# EAGLE design cnc_1_0_0 (EAGLE 6.2)

## Sheet 1 of 9
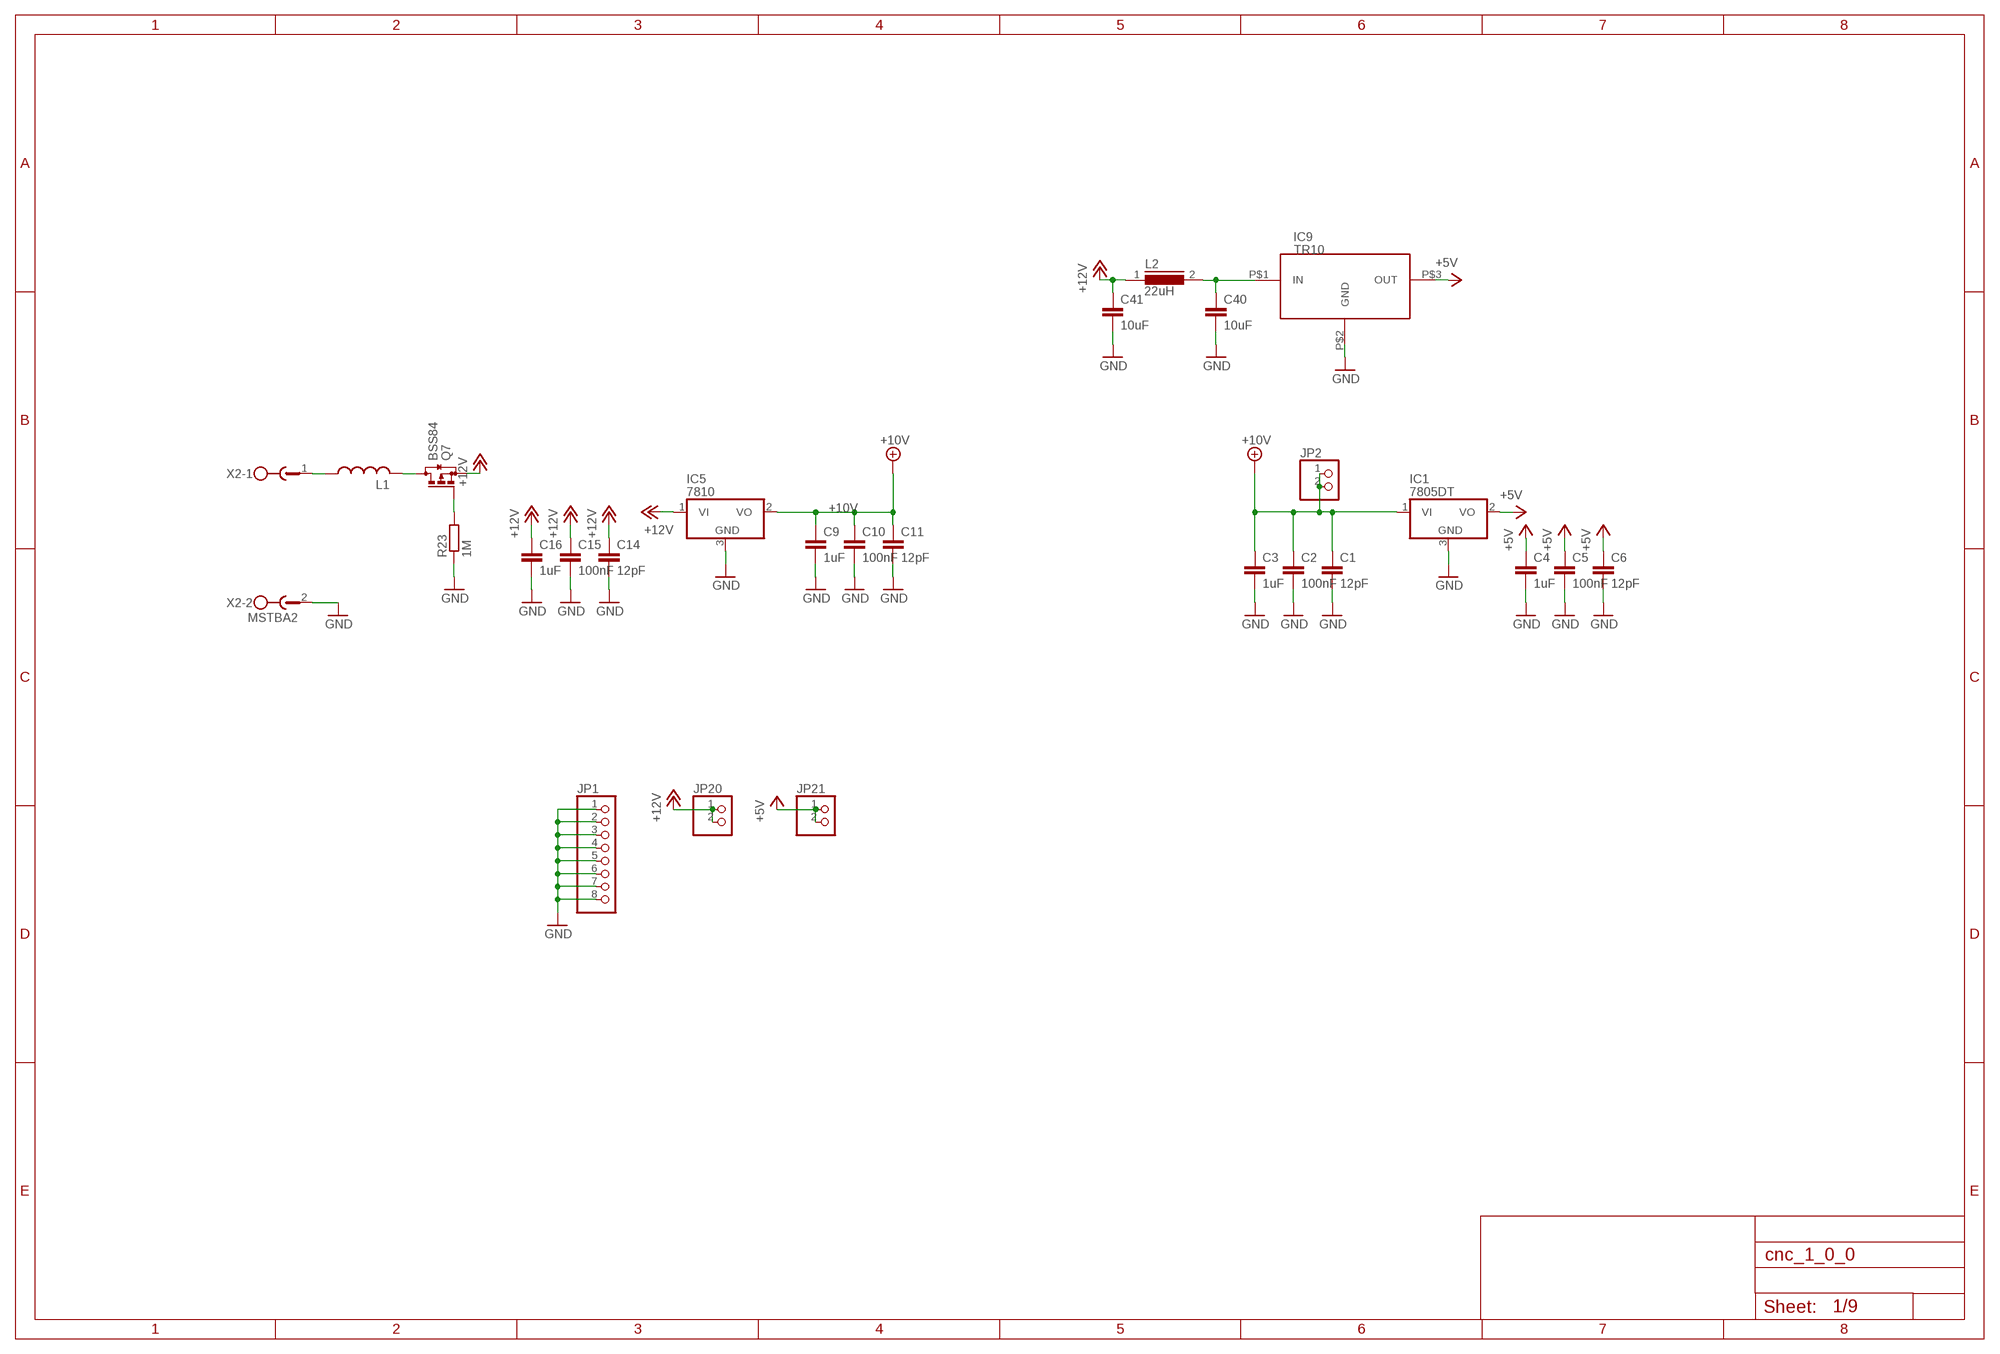
[diagram p0: schematic, sheet 1]

### Parts
C1  12pF  C-EUC0805K  [C0805K]
C2  100nF  C-EUC0805K  [C0805K]
C3  1uF  C-EUC0805K  [C0805K]
C4  1uF  C-EUC0805K  [C0805K]
C5  100nF  C-EUC0805K  [C0805K]
C6  12pF  C-EUC0805K  [C0805K]
C9  1uF  C-EUC0805K  [C0805K]
C10  100nF  C-EUC0805K  [C0805K]
C11  12pF  C-EUC0805K  [C0805K]
C14  12pF  C-EUC0805K  [C0805K]
C15  100nF  C-EUC0805K  [C0805K]
C16  1uF  C-EUC0805K  [C0805K]
C40  10uF  C-EUC0805K  [C0805K]
C41  10uF  C-EUC0805K  [C0805K]
IC1  7805DT  [TO252]
IC5  7810  7805DT  [TO252]
IC9  TR10  [TR10]
JP1  PINHD-1X8  [1X08]
JP2  PINHD-1X2  [1X02]
JP20  PINHD-1X2  [1X02]
JP21  PINHD-1X2  [1X02]
L1  L-USL1812  [L1812]
L2  22uH  DR127  [DR127]
Q7  BSS84  [SOT23]
R23  1M  R-EU_R0805  [R0805]
X2  MSTBA2  [MSTBA2]

### Nets
+5V [pwr]: C4.1 C5.1 C6.1 IC1.2(VO) IC9.P$3(OUT) JP21.1 JP21.2 ; also sheet 3,4,5
+10V [pwr]: C1.1 C2.1 C3.1 C9.1 C10.1 C11.1 IC1.1(VI) IC5.2(VO) JP2.1 JP2.2 ; also sheet 4
+12V [pwr]: C14.1 C15.1 C16.1 C41.1 IC5.1(VI) JP20.1 JP20.2 L2.1 Q7.2(S) ; also sheet 5,7
GND: C1.2 C2.2 C3.2 C4.2 C5.2 C6.2 C9.2 C10.2 C11.2 C14.2 C15.2 C16.2 C40.2 C41.2 IC1.3(GND) IC5.3(GND) IC9.P$2(GND) JP1.1 JP1.2 JP1.3 JP1.4 JP1.5 JP1.6 JP1.7 JP1.8 R23.1 X2.2 ; also sheet 2,3,4,5,6,7
N$1: L1.1 X2.1
N$24: L1.2 Q7.3(D)
N$25: Q7.1(G) R23.2
N$26: C40.1 IC9.P$1(IN) L2.2

## Sheet 2 of 9
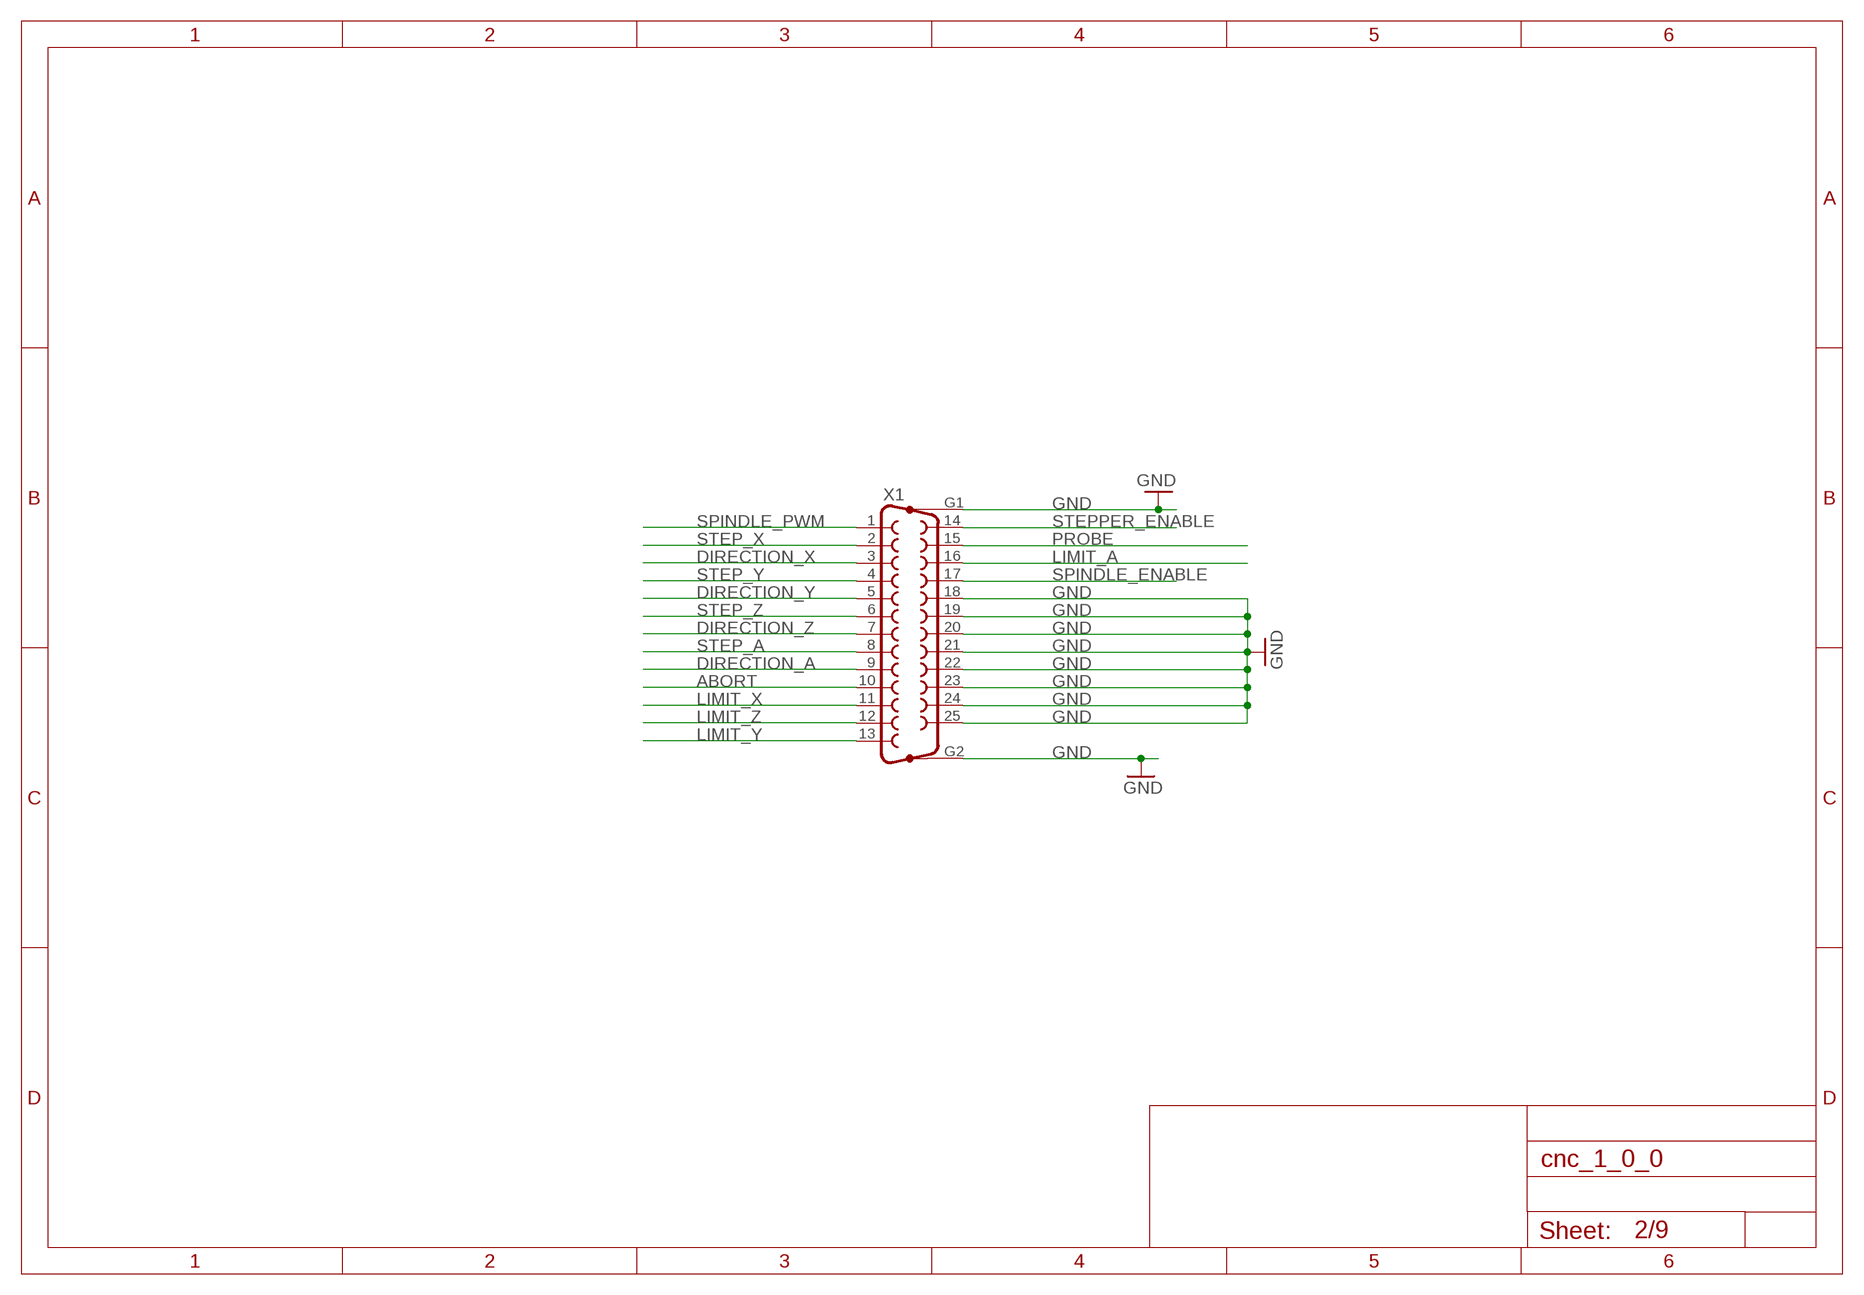
[diagram p1: schematic, sheet 2]

### Parts
X1  F25HP  [F25HP]

### Nets
ABORT: X1.10 ; also sheet 3,5
DIRECTION_A: X1.9 ; also sheet 3,4
DIRECTION_X: X1.3 ; also sheet 3,4
DIRECTION_Y: X1.5 ; also sheet 3,4
DIRECTION_Z: X1.7 ; also sheet 3,4
GND: X1.18 X1.19 X1.20 X1.21 X1.22 X1.23 X1.24 X1.25 X1.G1 X1.G2 ; also sheet 1,3,4,5,6,7
LIMIT_A: X1.16
LIMIT_X: X1.11 ; also sheet 3,5
LIMIT_Y: X1.13 ; also sheet 3,5
LIMIT_Z: X1.12 ; also sheet 3,5
PROBE: X1.15 ; also sheet 3,5
SPINDLE_ENABLE: X1.17 ; also sheet 3,4
SPINDLE_PWM: X1.1 ; also sheet 3,4
STEP_A: X1.8 ; also sheet 3,4
STEP_X: X1.2 ; also sheet 3,4
STEP_Y: X1.4 ; also sheet 3,4
STEP_Z: X1.6 ; also sheet 3,4
STEPPER_ENABLE: X1.14 ; also sheet 3,4

## Sheet 3 of 9
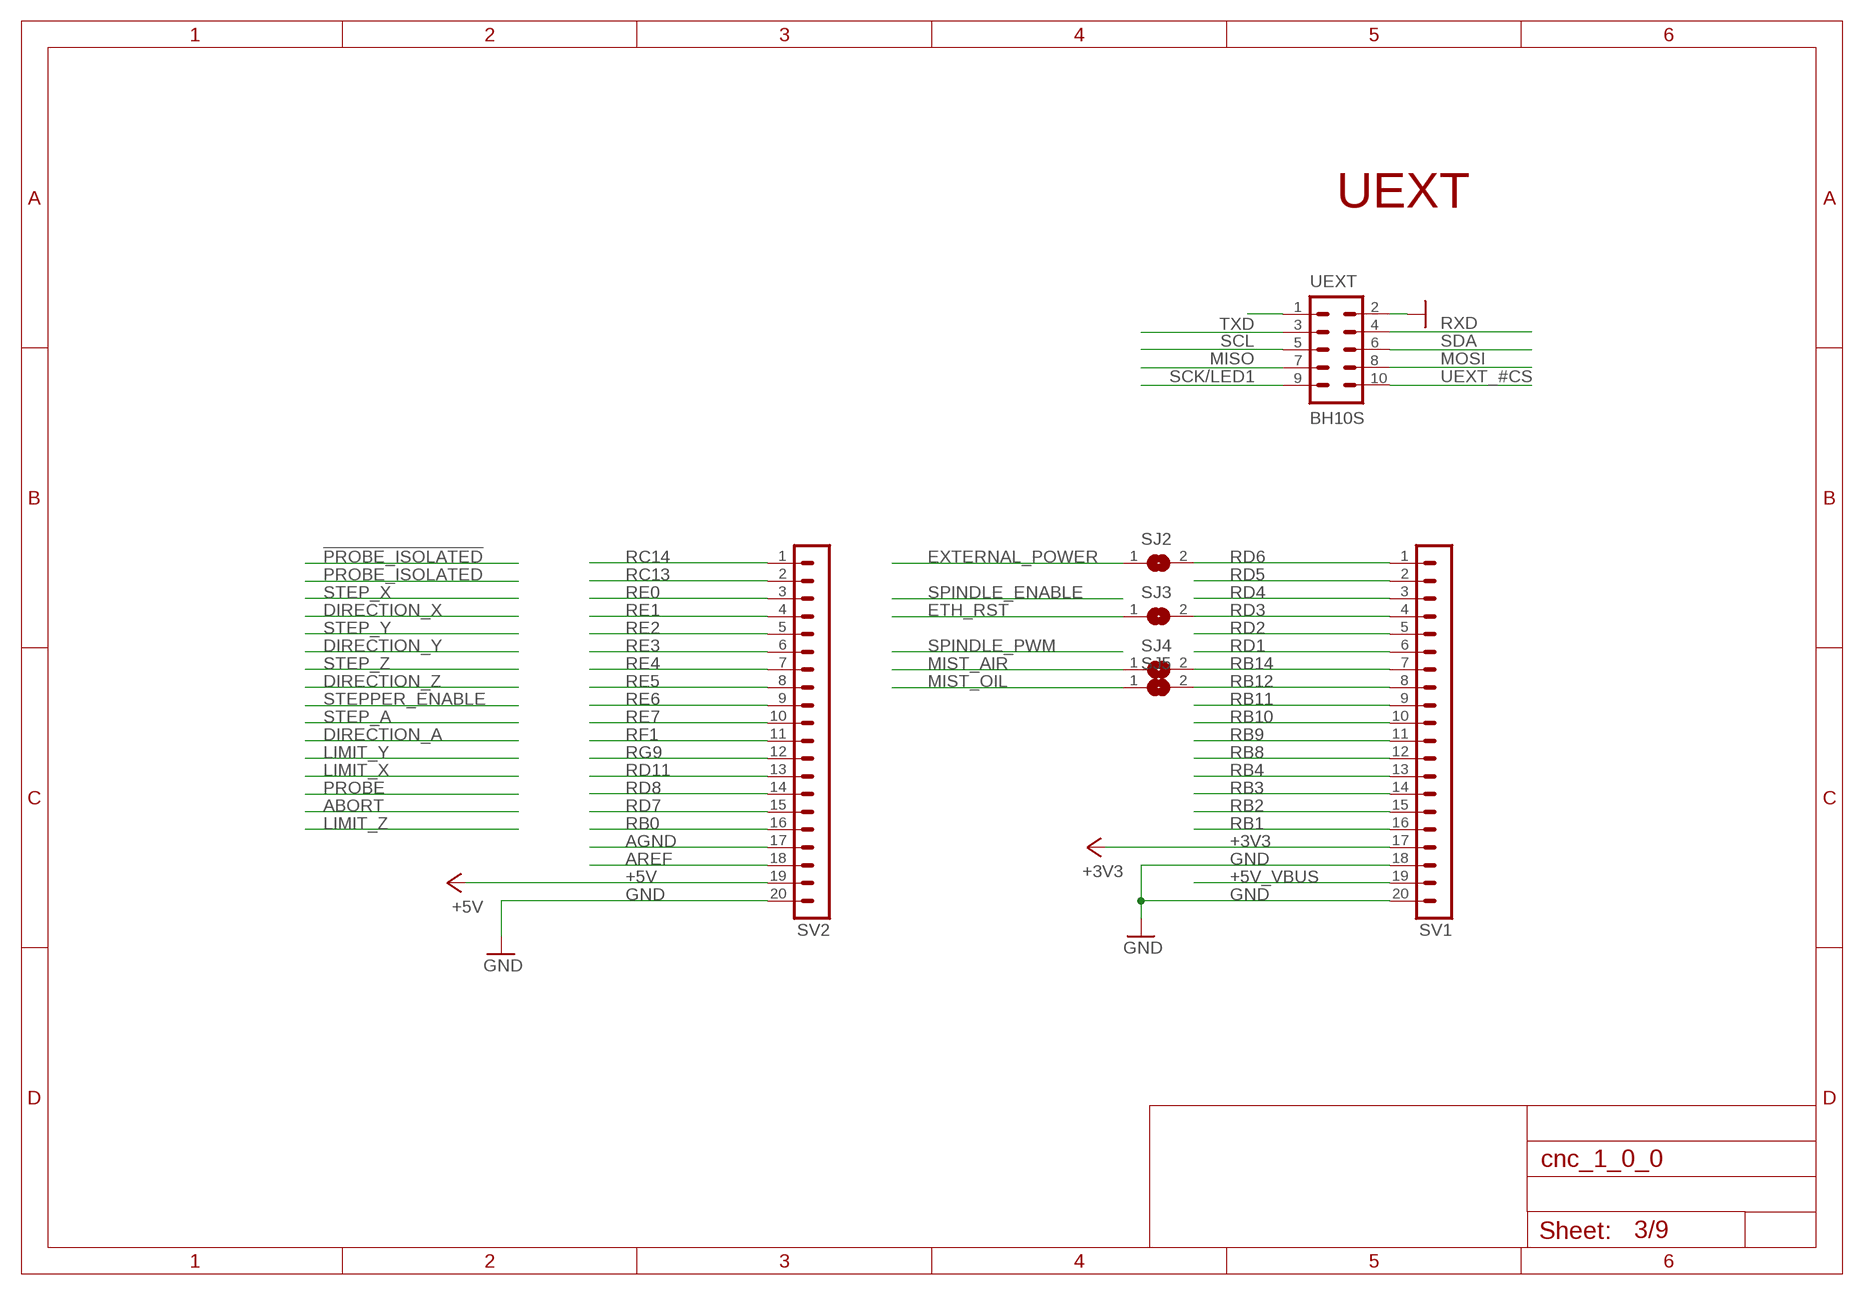
[diagram p2: schematic, sheet 3]

### Parts
SJ2  SJ  [SJ]
SJ3  SJ  [SJ]
SJ4  SJ  [SJ]
SJ5  SJ  [SJ]
SV1  MA20-1  [MA20-1]
SV2  MA20-1  [MA20-1]
UEXT  BH10S  ML10  [ML10-MALE]

### Nets
+3V3: SV1.17 ; also sheet 4,5,6
+5V [pwr]: SV2.19 ; also sheet 1,4,5
+5V_VBUS: SV1.19
AGND: SV2.17
AREF: SV2.18
ETH_RST: SJ3.1 ; also sheet 6
EXTERNAL_POWER: SJ2.1 ; also sheet 5
GND: SV1.18 SV1.20 SV2.20 UEXT.2 ; also sheet 1,2,4,5,6,7
MISO: UEXT.7 ; also sheet 6
MIST_AIR: SJ4.1 ; also sheet 7
MIST_OIL: SJ5.1 ; also sheet 7
MOSI: UEXT.8 ; also sheet 6
N$9: UEXT.1
RB0: SV2.16 ; also sheet 5
RB1: SV1.16
RB2: SV1.15
RB3: SV1.14
RB4: SV1.13
RB8: SV1.12
RB9: SV1.11
RB10: SV1.10
RB11: SV1.9
RB12: SJ5.2 SV1.8
RB14: SJ4.2 SV1.7
RC13: SV2.2 ; also sheet 5
RC14: SV2.1 ; also sheet 5
RD1: SV1.6 ; also sheet 4
RD2: SV1.5
RD3: SJ3.2 SV1.4
RD4 [signal]: SV1.3 ; also sheet 4
RD5: SV1.2
RD6: SJ2.2 SV1.1
RD7: SV2.15 ; also sheet 5
RD8: SV2.14 ; also sheet 5
RD11: SV2.13 ; also sheet 5
RE0: SV2.3 ; also sheet 4
RE1: SV2.4 ; also sheet 4
RE2: SV2.5 ; also sheet 4
RE3: SV2.6 ; also sheet 4
RE4: SV2.7 ; also sheet 4
RE5: SV2.8 ; also sheet 4
RE6: SV2.9 ; also sheet 4
RE7: SV2.10 ; also sheet 4
RF1: SV2.11 ; also sheet 4
RG9: SV2.12 ; also sheet 5
RXD: UEXT.4
SCK/LED1: UEXT.9 ; also sheet 6
SCL: UEXT.5
SDA: UEXT.6
TXD: UEXT.3
UEXT_#CS: UEXT.10 ; also sheet 6

### Notes on the sheet
- UEXT

## Sheet 4 of 9
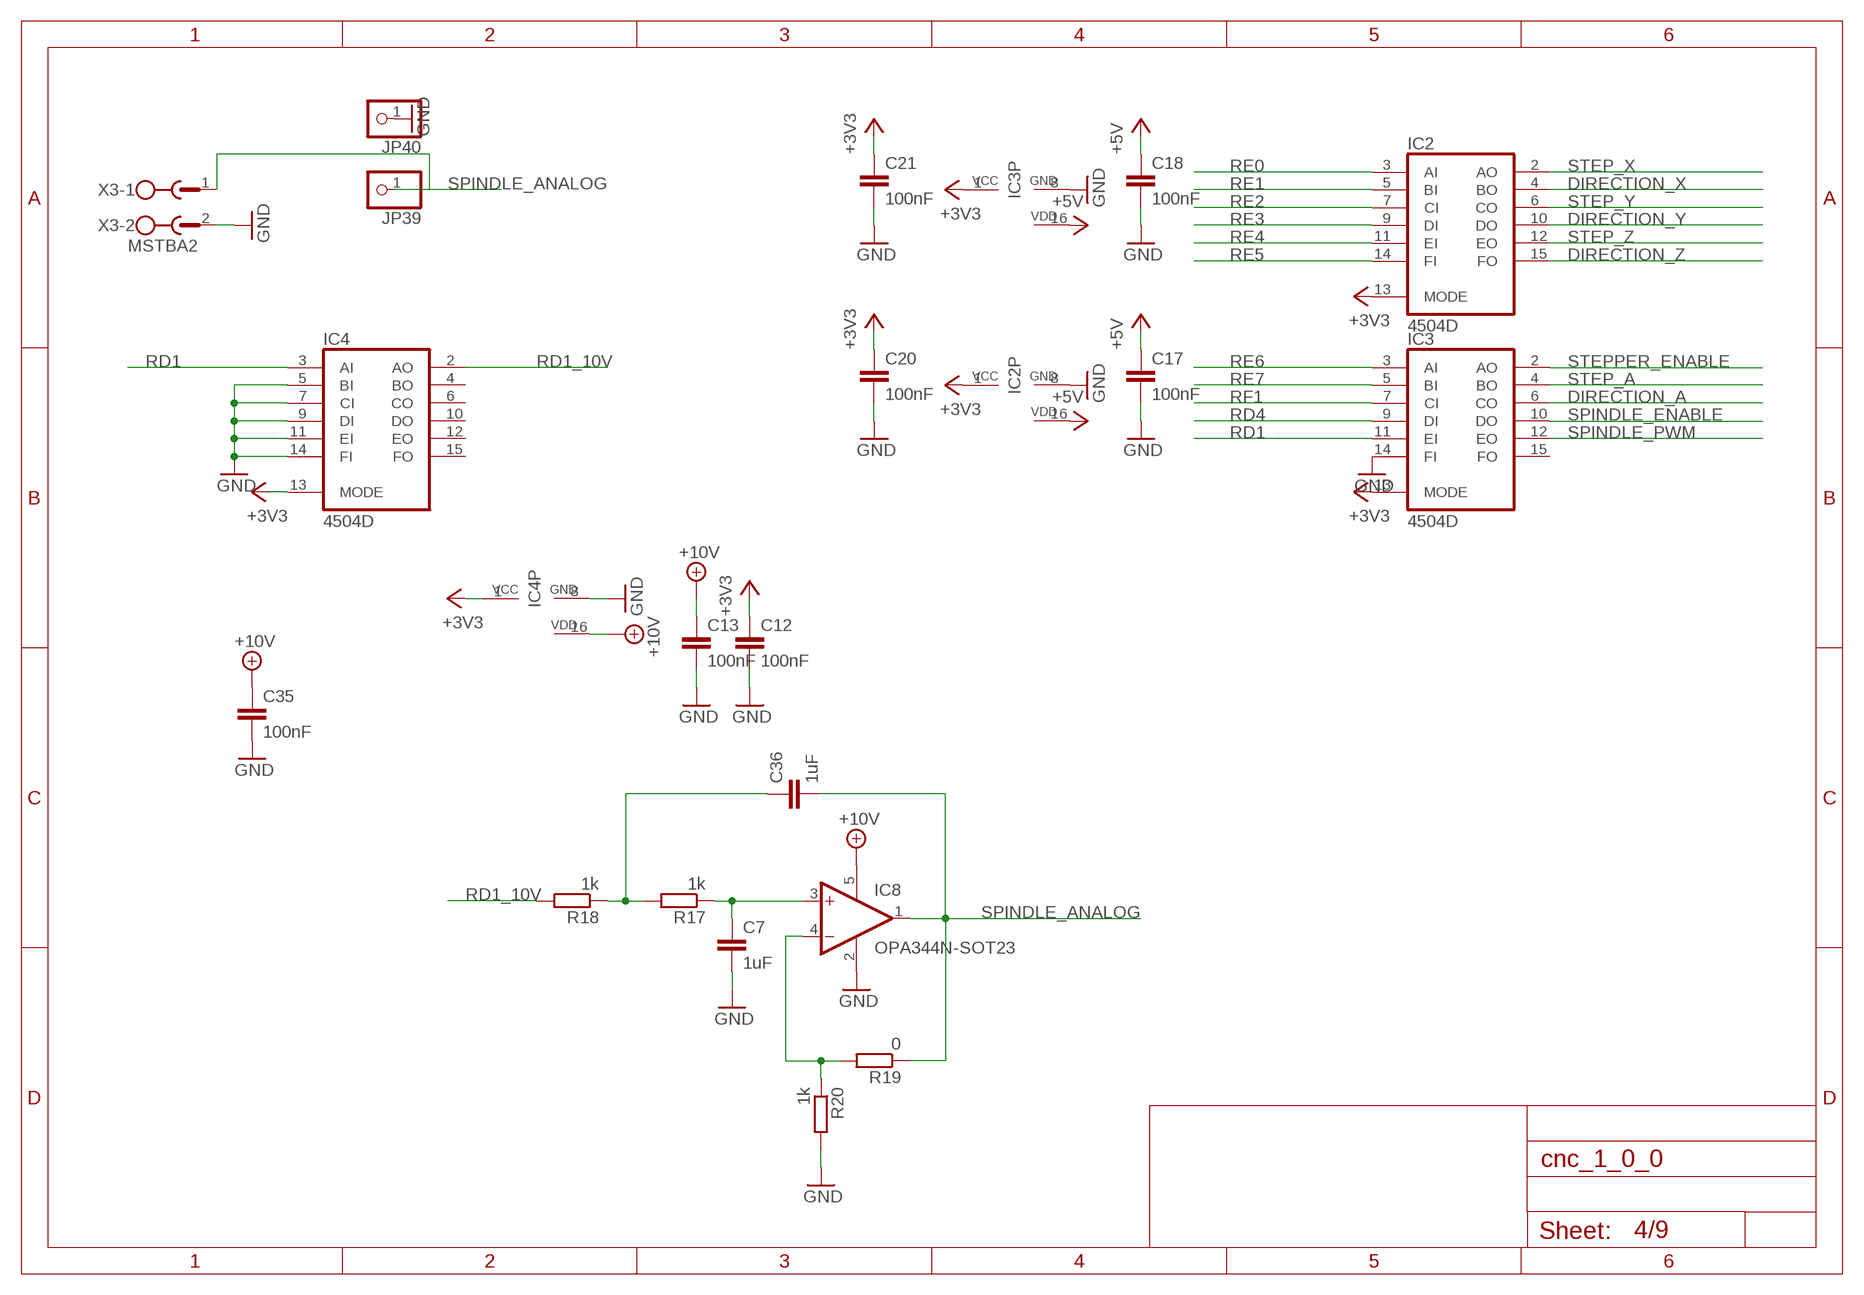
[diagram p3: schematic, sheet 4]

### Parts
C7  1uF  C-EUC0805K  [C0805K]
C12  100nF  C-EUC0805K  [C0805K]
C13  100nF  C-EUC0805K  [C0805K]
C17  100nF  C-EUC0805K  [C0805K]
C18  100nF  C-EUC0805K  [C0805K]
C20  100nF  C-EUC0805K  [C0805K]
C21  100nF  C-EUC0805K  [C0805K]
C35  100nF  C-EUC0805K  [C0805K]
C36  1uF  C-EUC0805K  [C0805K]
IC2  4504D  [SO16]
IC3  4504D  [SO16]
IC4  4504D  [SO16]
IC8  OPA344N-SOT23  [SOT23-5]
JP39  PINHD-1X1  [1X01]
JP40  PINHD-1X1  [1X01]
R17  1k  R-EU_R0805  [R0805]
R18  1k  R-EU_R0805  [R0805]
R19  0  R-EU_R0805  [R0805]
R20  1k  R-EU_R0805  [R0805]
X3  MSTBA2  [MSTBA2]

### Nets
+3V3: C12.1 C20.1 C21.1 IC2.1(VCC) IC2.13(MODE) IC3.1(VCC) IC3.13(MODE) IC4.1(VCC) IC4.13(MODE) ; also sheet 3,5,6
+5V [pwr]: C17.1 C18.1 IC2.16(VDD) IC3.16(VDD) ; also sheet 1,3,5
+10V [pwr]: C13.1 C35.1 IC4.16(VDD) IC8.5(V+) ; also sheet 1
DIRECTION_A: IC3.6(CO) ; also sheet 2,3
DIRECTION_X: IC2.4(BO) ; also sheet 2,3
DIRECTION_Y: IC2.10(DO) ; also sheet 2,3
DIRECTION_Z: IC2.15(FO) ; also sheet 2,3
GND: C7.2 C12.2 C13.2 C17.2 C18.2 C20.2 C21.2 C35.2 IC2.8(GND) IC3.8(GND) IC3.14(FI) IC4.5(BI) IC4.7(CI) IC4.8(GND) IC4.9(DI) IC4.11(EI) IC4.14(FI) IC8.2(V-) JP40.1 R20.2 X3.2 ; also sheet 1,2,3,5,6,7
N$3: C36.1 R17.2 R18.1
N$15: C7.1 IC8.3(+IN) R17.1
N$16: IC8.4(-IN) R19.2 R20.1
RD1: IC3.11(EI) IC4.3(AI) ; also sheet 3
RD1_10V: IC4.2(AO) R18.2
RD4 [signal]: IC3.9(DI) ; also sheet 3
RE0: IC2.3(AI) ; also sheet 3
RE1: IC2.5(BI) ; also sheet 3
RE2: IC2.7(CI) ; also sheet 3
RE3: IC2.9(DI) ; also sheet 3
RE4: IC2.11(EI) ; also sheet 3
RE5: IC2.14(FI) ; also sheet 3
RE6: IC3.3(AI) ; also sheet 3
RE7: IC3.5(BI) ; also sheet 3
RF1: IC3.7(CI) ; also sheet 3
SPINDLE_ANALOG: C36.2 IC8.1(OUT) JP39.1 R19.1 X3.1
SPINDLE_ENABLE: IC3.10(DO) ; also sheet 2,3
SPINDLE_PWM: IC3.12(EO) ; also sheet 2,3
STEP_A: IC3.4(BO) ; also sheet 2,3
STEP_X: IC2.2(AO) ; also sheet 2,3
STEP_Y: IC2.6(CO) ; also sheet 2,3
STEP_Z: IC2.12(EO) ; also sheet 2,3
STEPPER_ENABLE: IC3.2(AO) ; also sheet 2,3
Unconnected: IC3.15(FO) IC4.4(BO) IC4.6(CO) IC4.10(DO) IC4.12(EO) IC4.15(FO)

## Sheet 5 of 9
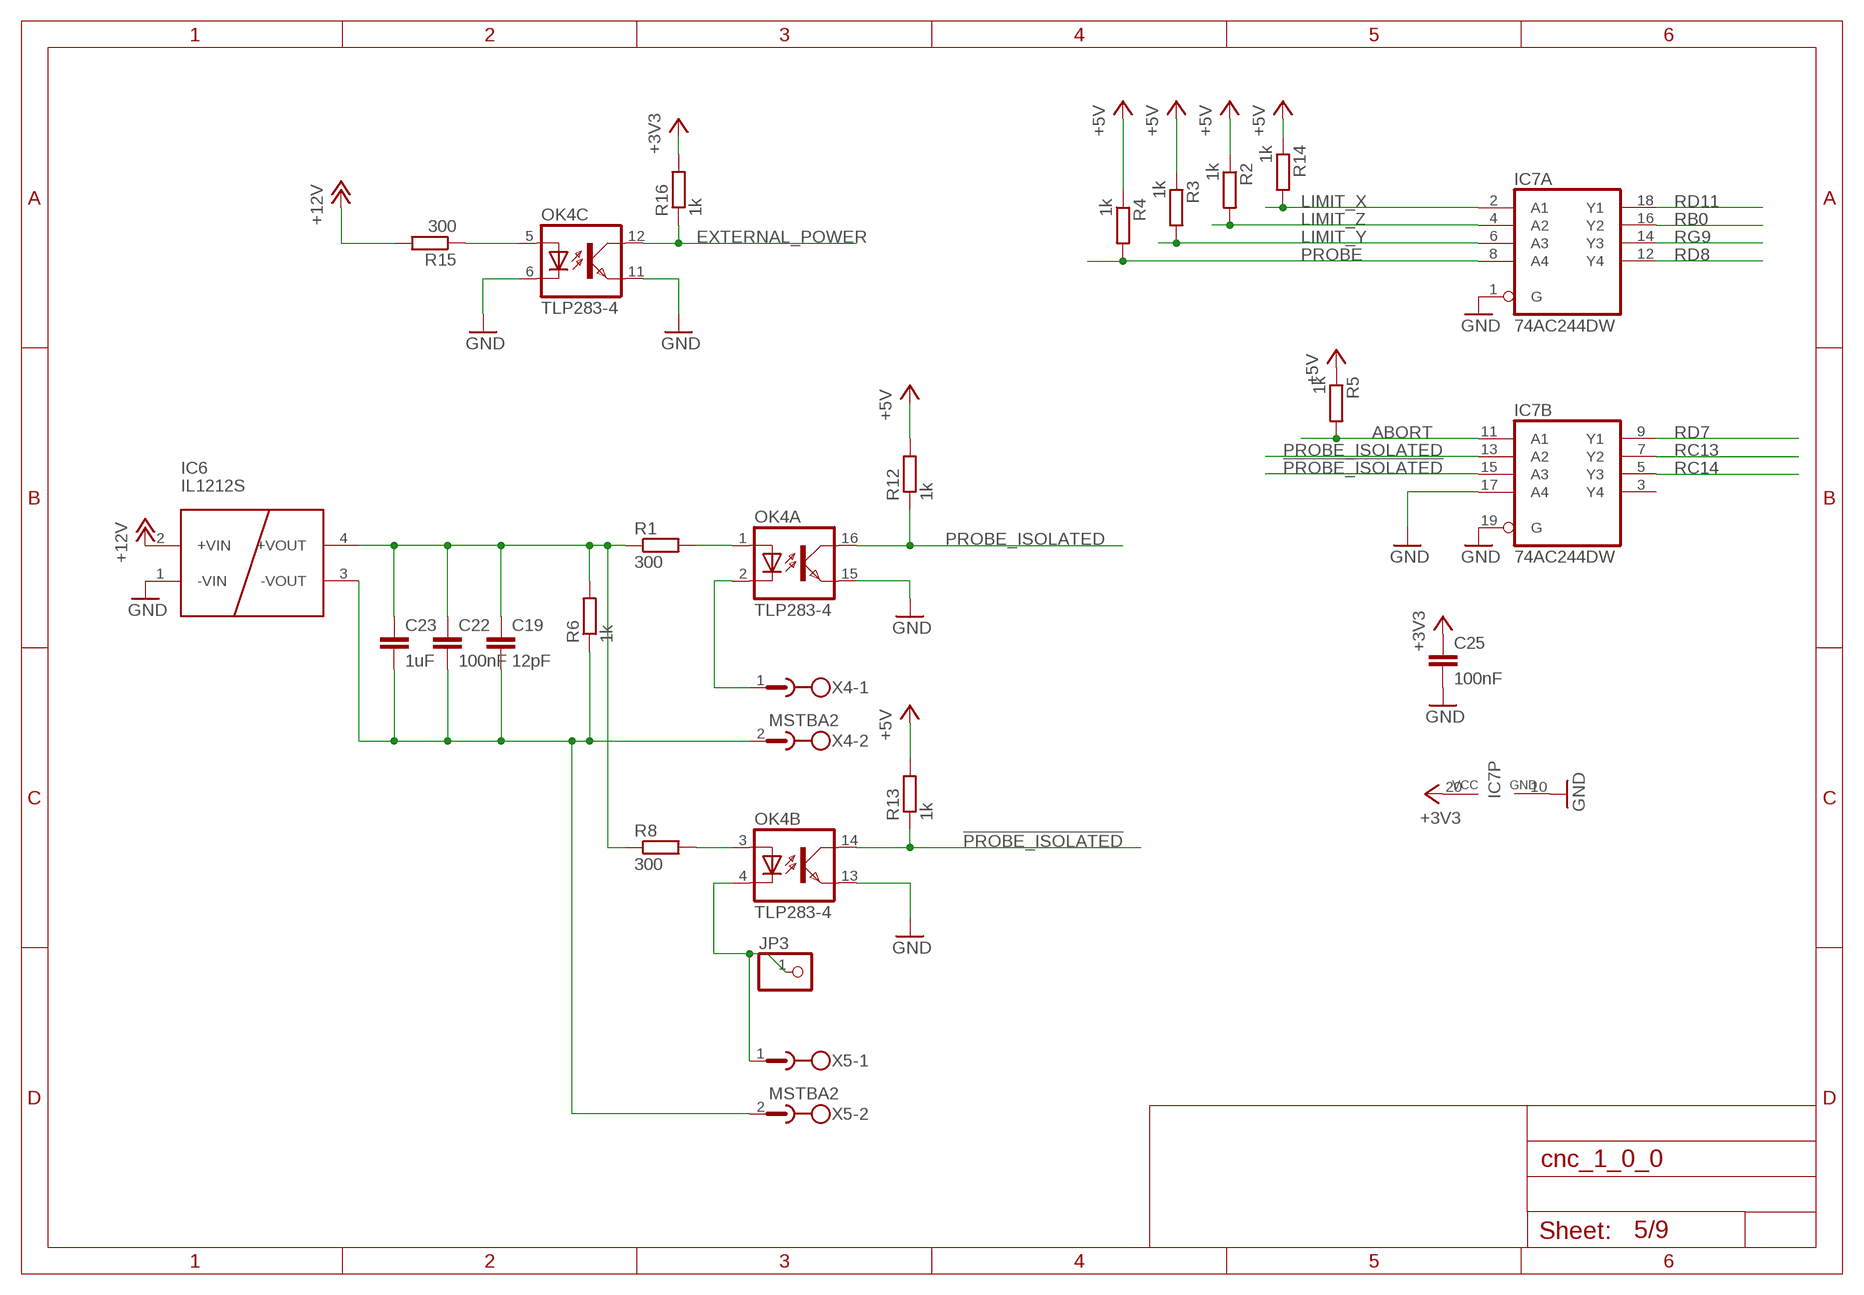
[diagram p4: schematic, sheet 5]

### Parts
C19  12pF  C-EUC0805K  [C0805K]
C22  100nF  C-EUC0805K  [C0805K]
C23  1uF  C-EUC0805K  [C0805K]
C25  100nF  C-EUC0805K  [C0805K]
IC6  IL1212S  IL0512S  [SIL4]
IC7  74AC244DW  [SO20W]
JP3  PINHD-1X1  [1X01]
OK4  TLP283-4  [MINI-FLAT-16]
R1  300  R-EU_R0805  [R0805]
R2  1k  R-EU_R0805  [R0805]
R3  1k  R-EU_R0805  [R0805]
R4  1k  R-EU_R0805  [R0805]
R5  1k  R-EU_R0805  [R0805]
R6  1k  R-EU_R0805  [R0805]
R8  300  R-EU_R0805  [R0805]
R12  1k  R-EU_R0805  [R0805]
R13  1k  R-EU_R0805  [R0805]
R14  1k  R-EU_R0805  [R0805]
R15  300  R-EU_R0805  [R0805]
R16  1k  R-EU_R0805  [R0805]
X4  MSTBA2  [MSTBA2]
X5  MSTBA2  [MSTBA2]

### Nets
!PROBE_ISOLATED: IC7.15(B:A3) OK4.14(B:COL) R13.1 ; also sheet 3
+3V3: C25.1 IC7.20(P:VCC) R16.2 ; also sheet 3,4,6
+5V [pwr]: R2.1 R3.1 R4.1 R5.1 R12.2 R13.2 R14.1 ; also sheet 1,3,4
+10V1: C19.1 C22.1 C23.1 IC6.4(+VOUT) R1.1 R6.2 R8.1
+12V [pwr]: IC6.2(+VIN) R15.2 ; also sheet 1,7
ABORT: IC7.11(B:A1) R5.2 ; also sheet 2,3
EXTERNAL_POWER: OK4.12(C:COL) R16.1 ; also sheet 3
GND: C25.2 IC6.1(-VIN) IC7.1(A:G) IC7.10(P:GND) IC7.17(B:A4) IC7.19(B:G) OK4.6(C:C) OK4.11(C:EMIT) OK4.13(B:EMIT) OK4.15(A:EMIT) ; also sheet 1,2,3,4,6,7
LIMIT_X: IC7.2(A:A1) R14.2 ; also sheet 2,3
LIMIT_Y: IC7.6(A:A3) R3.2 ; also sheet 2,3
LIMIT_Z: IC7.4(A:A2) R2.2 ; also sheet 2,3
N$5: OK4.1(A:A) R1.2
N$6: OK4.2(A:C) X4.1
N$7: C19.2 C22.2 C23.2 IC6.3(-VOUT) R6.1 X4.2 X5.2
N$11: OK4.3(B:A) R8.2
N$12: JP3.1 OK4.4(B:C) X5.1
N$13: OK4.5(C:A) R15.1
PROBE: IC7.8(A:A4) R4.2 ; also sheet 2,3
PROBE_ISOLATED: IC7.13(B:A2) OK4.16(A:COL) R12.1 ; also sheet 3
RB0: IC7.16(A:Y2) ; also sheet 3
RC13: IC7.7(B:Y2) ; also sheet 3
RC14: IC7.5(B:Y3) ; also sheet 3
RD7: IC7.9(B:Y1) ; also sheet 3
RD8: IC7.12(A:Y4) ; also sheet 3
RD11: IC7.18(A:Y1) ; also sheet 3
RG9: IC7.14(A:Y3) ; also sheet 3
Unconnected: IC7.3(B:Y4) OK4.7(D:A) OK4.8(D:C) OK4.9(D:EMIT) OK4.10(D:COL)

## Sheet 6 of 9
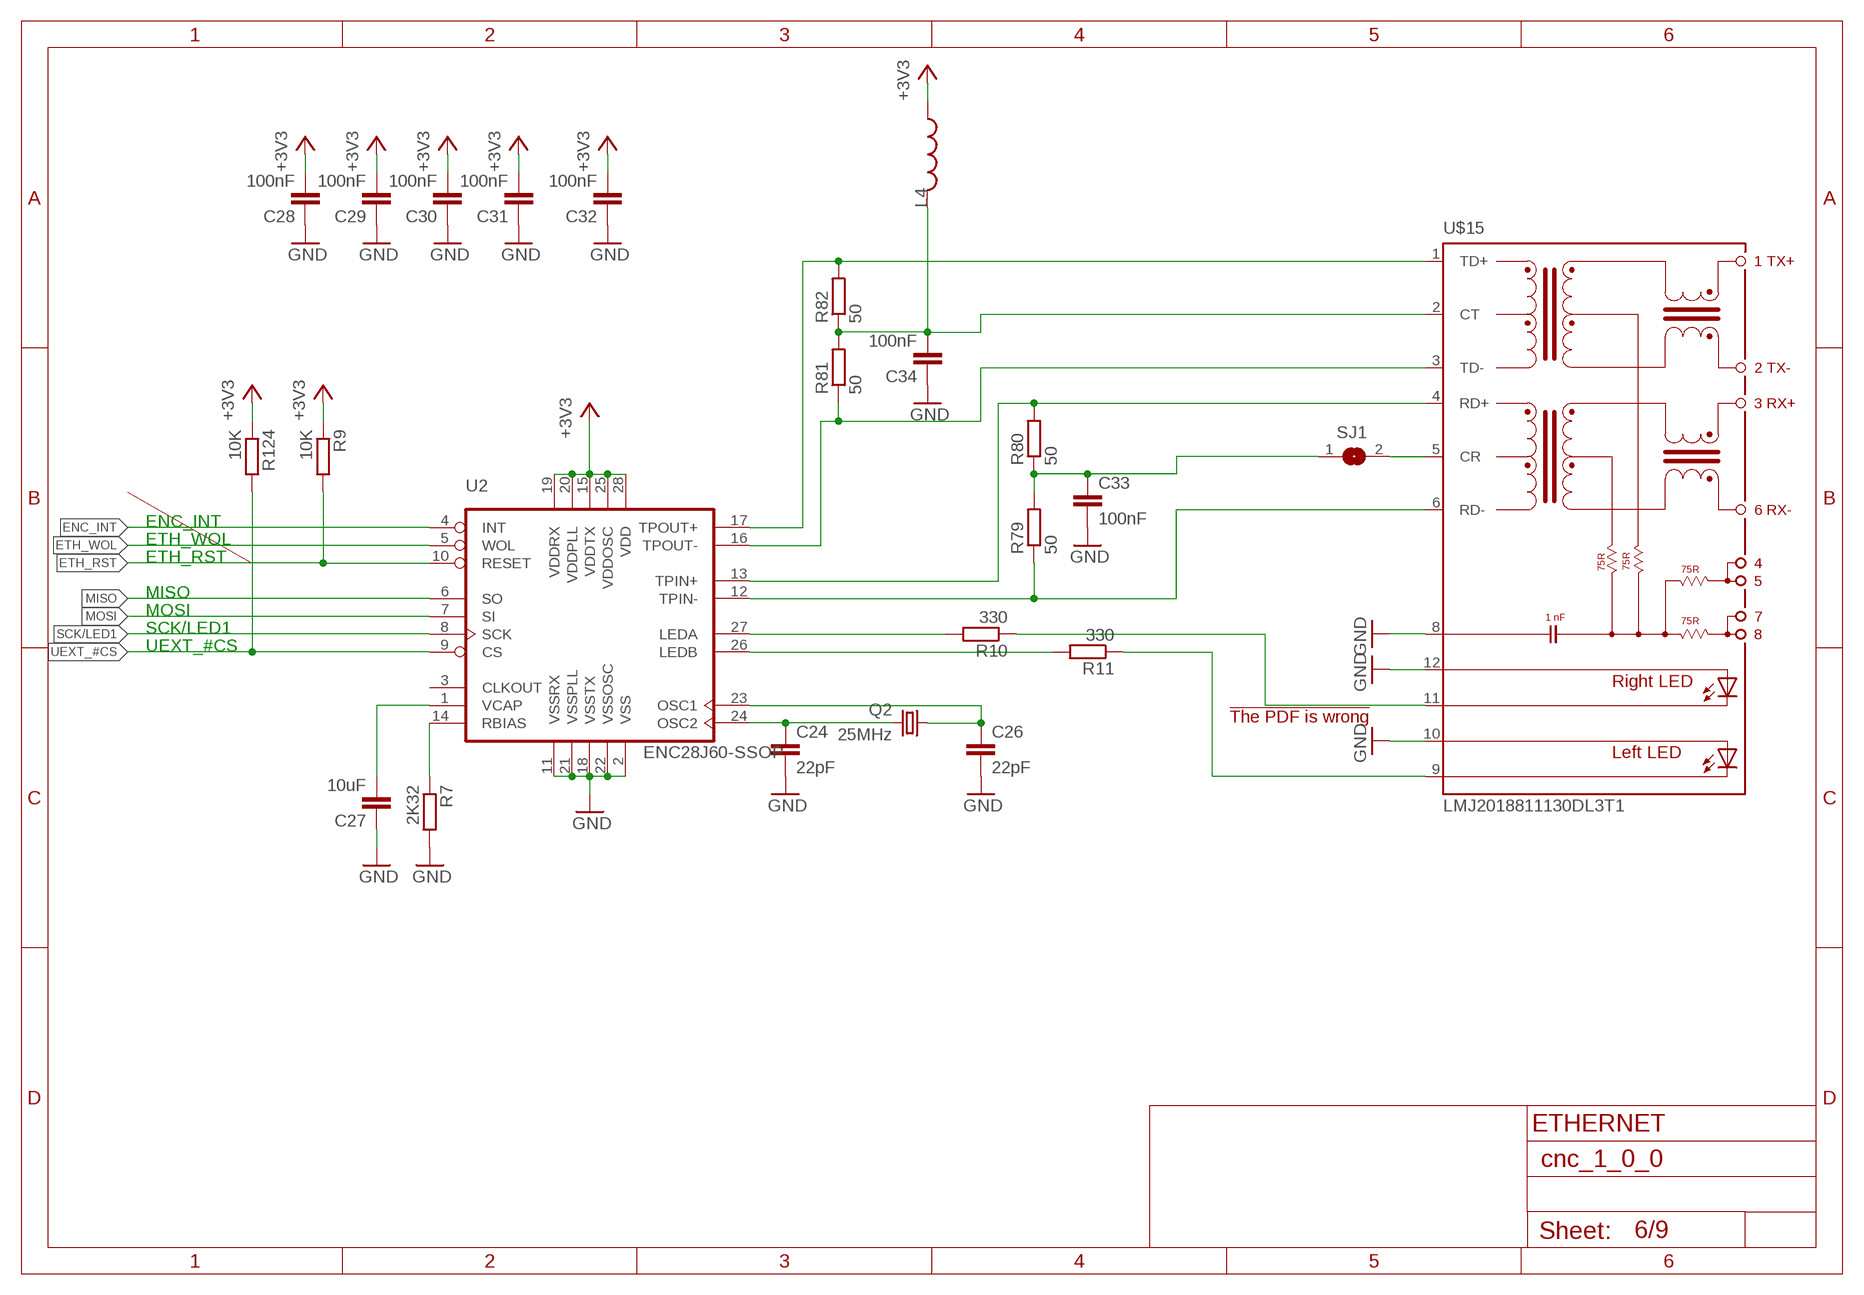
[diagram p5: schematic, sheet 6]

### Parts
C24  22pF  C-EUC0603  [C0603]
C26  22pF  C-EUC0603  [C0603]
C27  10uF  C-EUC0805K  [C0805K]
C28  100nF  C-EUC0603  [C0603]
C29  100nF  C-EUC0603  [C0603]
C30  100nF  C-EUC0603  [C0603]
C31  100nF  C-EUC0603  [C0603]
C32  100nF  C-EUC0603  [C0603]
C33  100nF  C-EUC0603  [C0603]
C34  100nF  C-EUC0603  [C0603]
L4  INDUCTOR0603  [0603]
Q2  25MHz  CRYSTAL5X3  [CRYSTAL-SMD-5X3]
R7  2K32  R-EU_R0805  [R0805]
R9  10K  R-EU_R0805  [R0805]
R10  330  R-EU_R0805  [R0805]
R11  330  R-EU_R0805  [R0805]
R79  50  R-EU_R0603  [R0603]
R80  50  R-EU_R0603  [R0603]
R81  50  R-EU_R0603  [R0603]
R82  50  R-EU_R0603  [R0603]
R124  10K  R-EU_R0805  [R0805]
SJ1  SJ  [SJ]
U2  ENC28J60-SSOP  [SSOP28]
U$15  LMJ2018811130DL3T1  AMPHENOL-LMJ2018814100DL2T1B_LMJ2018814100DL  [AMPHENOL-LMJ2018814100DL2T1B_RJ45]

### Nets
+3V3: C28.2 C29.2 C30.2 C31.2 C32.2 L4.1 R9.1 R124.1 U2.15(VDDTX) U2.19(VDDRX) U2.20(VDDPLL) U2.25(VDDOSC) U2.28(VDD) ; also sheet 3,4,5
CT1: C34.2 L4.2 R81.2 R82.1 U$15.2(CT)
ENC_INT: U2.4(INT)
ETH_RST: R9.2 U2.10(RESET) ; also sheet 3
ETH_WOL: U2.5(WOL)
GND: C24.2 C26.2 C27.1 C28.1 C29.1 C30.1 C31.1 C32.1 C33.2 C34.1 R7.2 U2.2(VSS) U2.11(VSSRX) U2.18(VSSTX) U2.21(VSSPLL) U2.22(VSSOSC) U$15.8 U$15.10(A-L) U$15.12(A-R) ; also sheet 1,2,3,4,5,7
MISO: U2.6(SO) ; also sheet 3
MOSI: U2.7(SI) ; also sheet 3
N$2: C24.1 Q2.3 U2.24(OSC2)
N$4: R11.2 U2.26(LEDB)
N$8: SJ1.2 U$15.5(CR)
N$10: R10.2 U2.27(LEDA)
N$53: C26.1 Q2.1 U2.23(OSC1)
N$54: R7.1 U2.14(RBIAS)
N$55: C27.2 U2.1(VCAP)
N$57: C33.1 R79.2 R80.1 SJ1.1
N$74: R10.1 U$15.11(C-R)
N$76: R11.1 U$15.9(C-L)
SCK/LED1: U2.8(SCK) ; also sheet 3
TPIN+: R80.2 U2.13(TPIN+) U$15.4(RD+)
TPIN-: R79.1 U2.12(TPIN-) U$15.6(RD-)
TPOUT+: R82.2 U2.17(TPOUT+) U$15.1(TD+)
TPOUT-: R81.1 U2.16(TPOUT-) U$15.3(TD-)
UEXT_#CS: R124.2 U2.9(CS) ; also sheet 3
Unconnected: U2.3(CLKOUT)

### Notes on the sheet
- !The PDF is wrong!
- ETHERNET

## Sheet 7 of 9
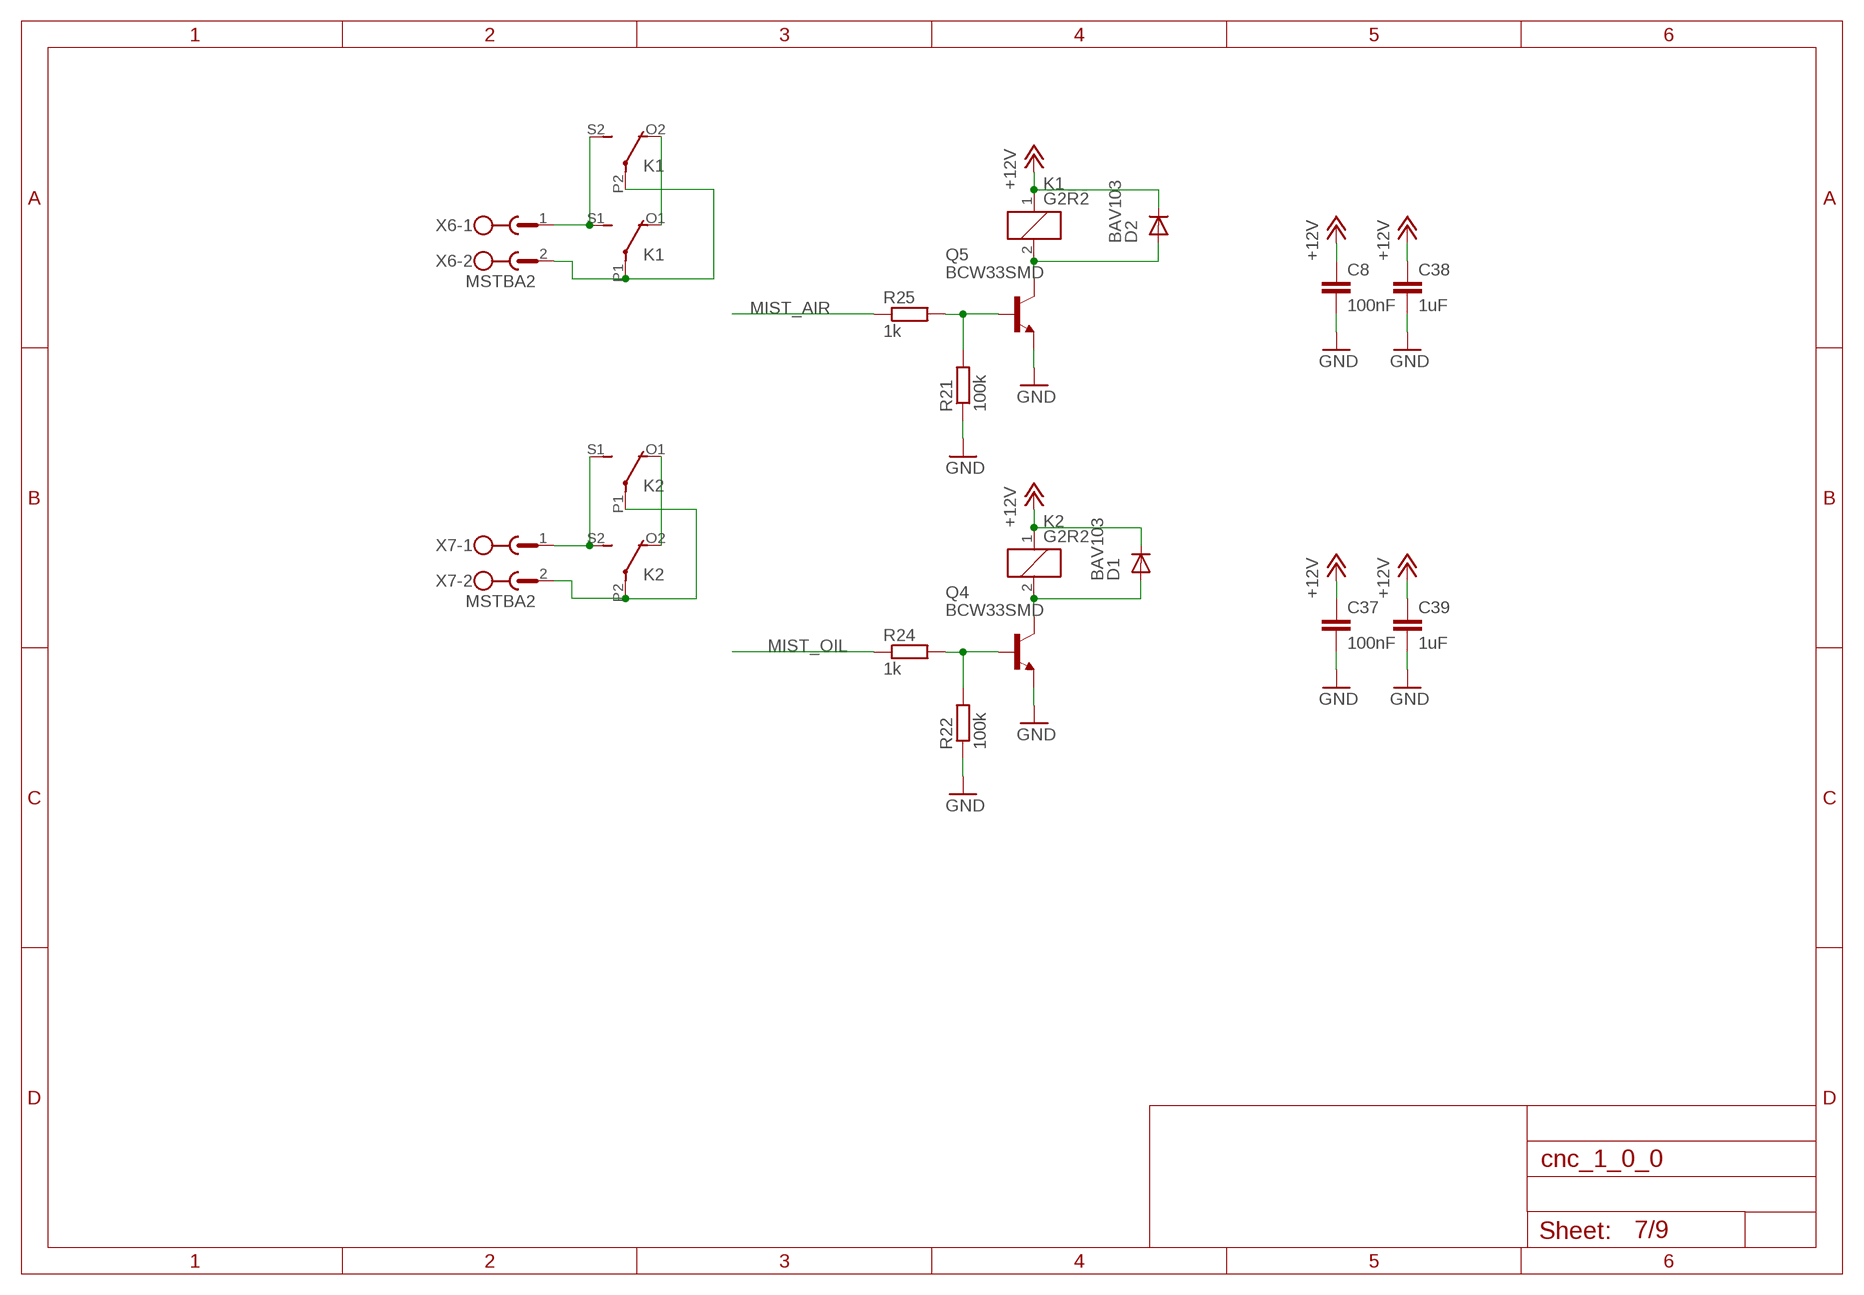
[diagram p6: schematic, sheet 7]

### Parts
C8  100nF  C-EUC0805K  [C0805K]
C37  100nF  C-EUC0805K  [C0805K]
C38  1uF  C-EUC0805K  [C0805K]
C39  1uF  C-EUC0805K  [C0805K]
D1  BAV103  DIODE-MINIMELF  [MINIMELF]
D2  BAV103  DIODE-MINIMELF  [MINIMELF]
K1  G2R2  [G2R2]
K2  G2R2  [G2R2]
Q4  BCW33SMD  [SOT23-BEC]
Q5  BCW33SMD  [SOT23-BEC]
R21  100k  R-EU_R0805  [R0805]
R22  100k  R-EU_R0805  [R0805]
R24  1k  R-EU_R0805  [R0805]
R25  1k  R-EU_R0805  [R0805]
X6  MSTBA2  [MSTBA2]
X7  MSTBA2  [MSTBA2]

### Nets
+12V [pwr]: C8.1 C37.1 C38.1 C39.1 D1.C D2.C K1.1 K2.1 ; also sheet 1,5
GND: C8.2 C37.2 C38.2 C39.2 Q4.E Q5.E R21.1 R22.1 ; also sheet 1,2,3,4,5,6
MIST_AIR: R25.1 ; also sheet 3
MIST_OIL: R24.1 ; also sheet 3
N$14: K2.S1(2:S) K2.S2(3:S) X7.1
N$17: K2.O1(2:O) K2.O2(3:O)
N$18: K2.P1(2:P) K2.P2(3:P) X7.2
N$19: K1.P1(2:P) K1.P2(3:P) X6.2
N$20: K1.O1(2:O) K1.O2(3:O)
N$21: K1.S1(2:S) K1.S2(3:S) X6.1
N$22: D2.A K1.2 Q5.C
N$23: D1.A K2.2 Q4.C
N$27: Q4.B R22.2 R24.2
N$28: Q5.B R21.2 R25.2

## Sheet 8 of 9
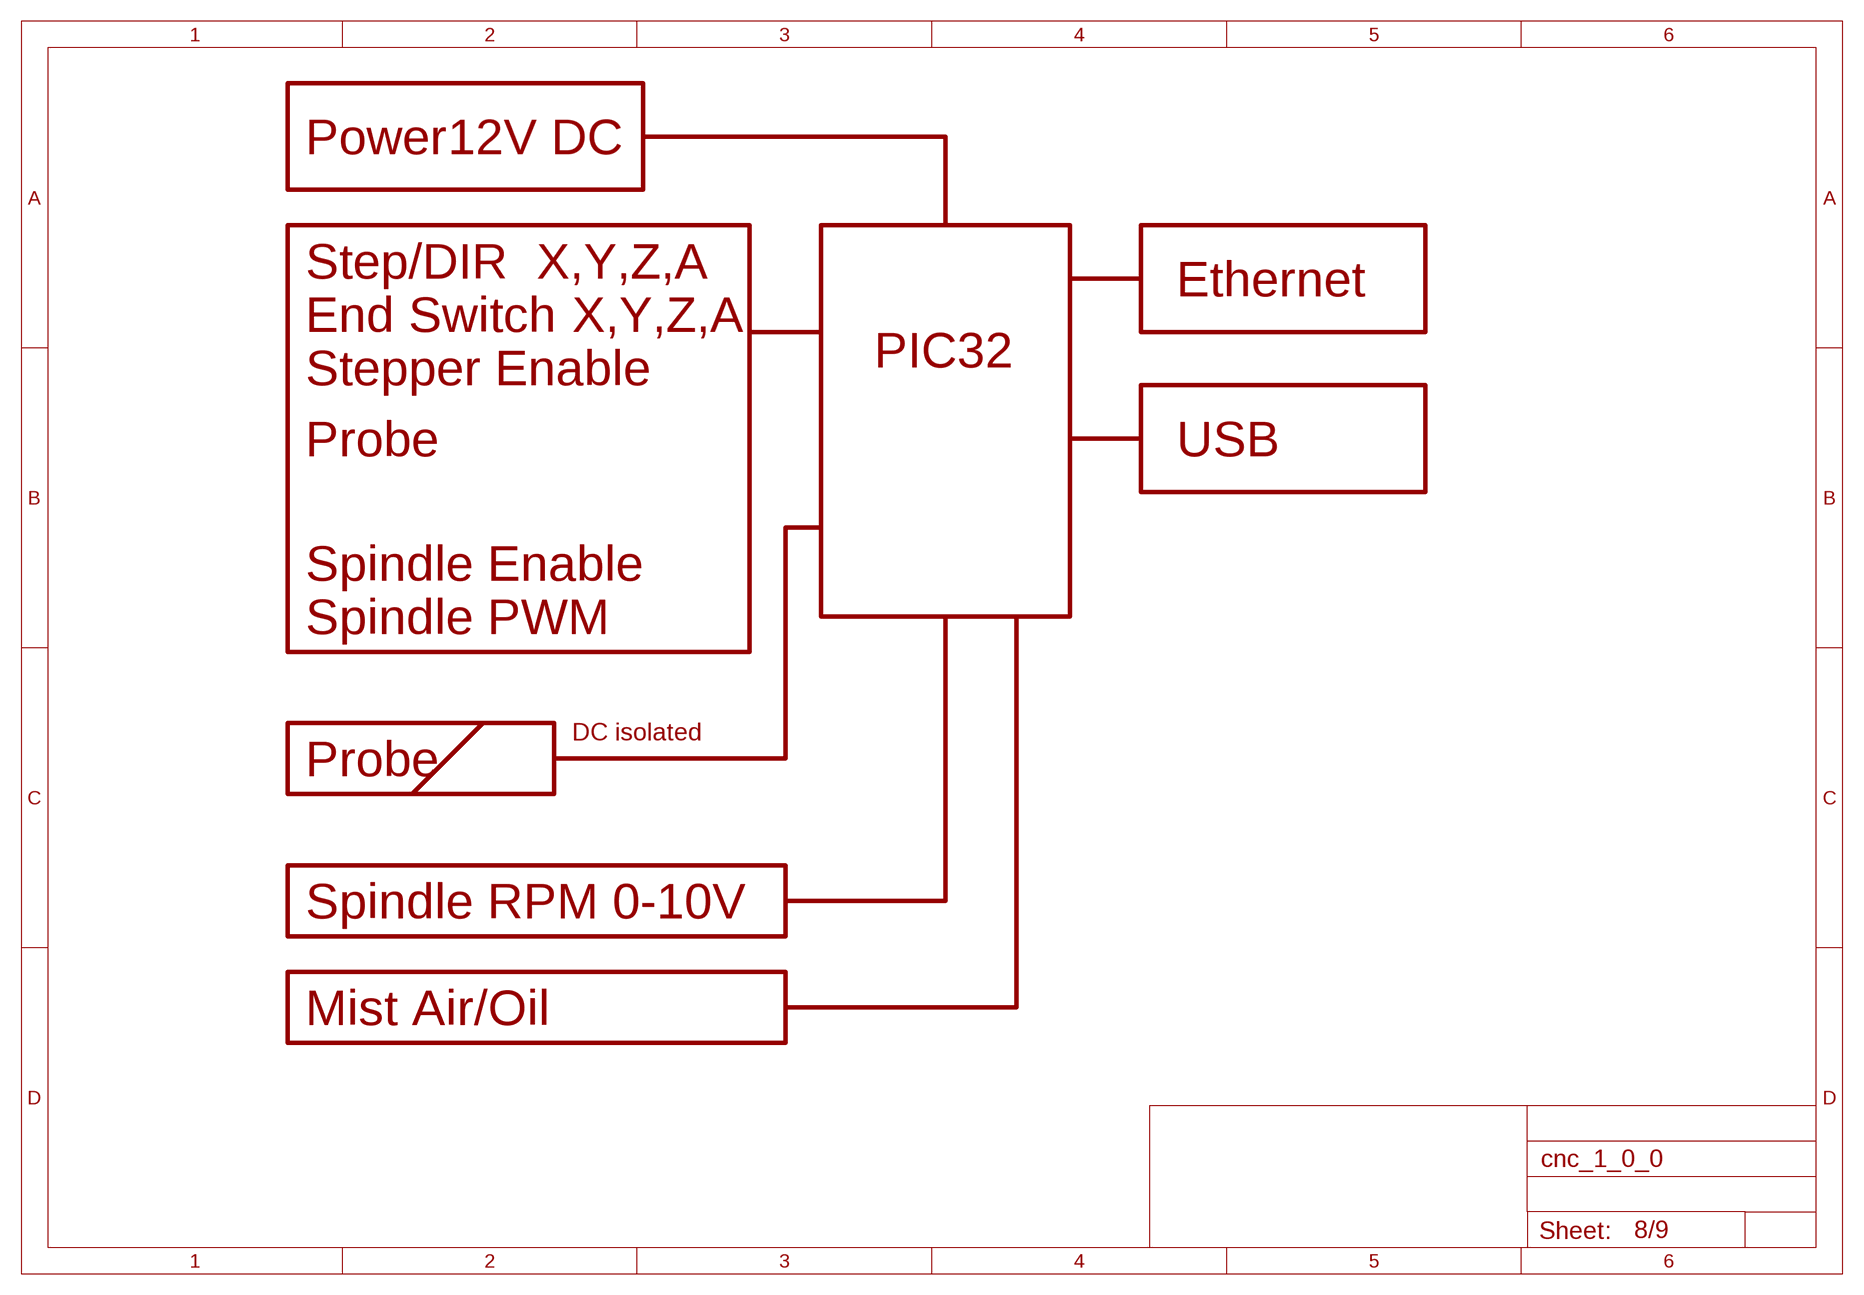
[diagram p7: schematic, sheet 8]

### Notes on the sheet
- Power | 12V DC
- Step/DIR | X,Y,Z,A
- Ethernet
- End Switch | X,Y,Z,A
- PIC32
- Stepper Enable
- Probe | USB
- Spindle Enable
- Spindle PWM
- DC isolated
- Probe
- Spindle RPM 0-10V
- Mist Air/Oil

## Sheet 9 of 9
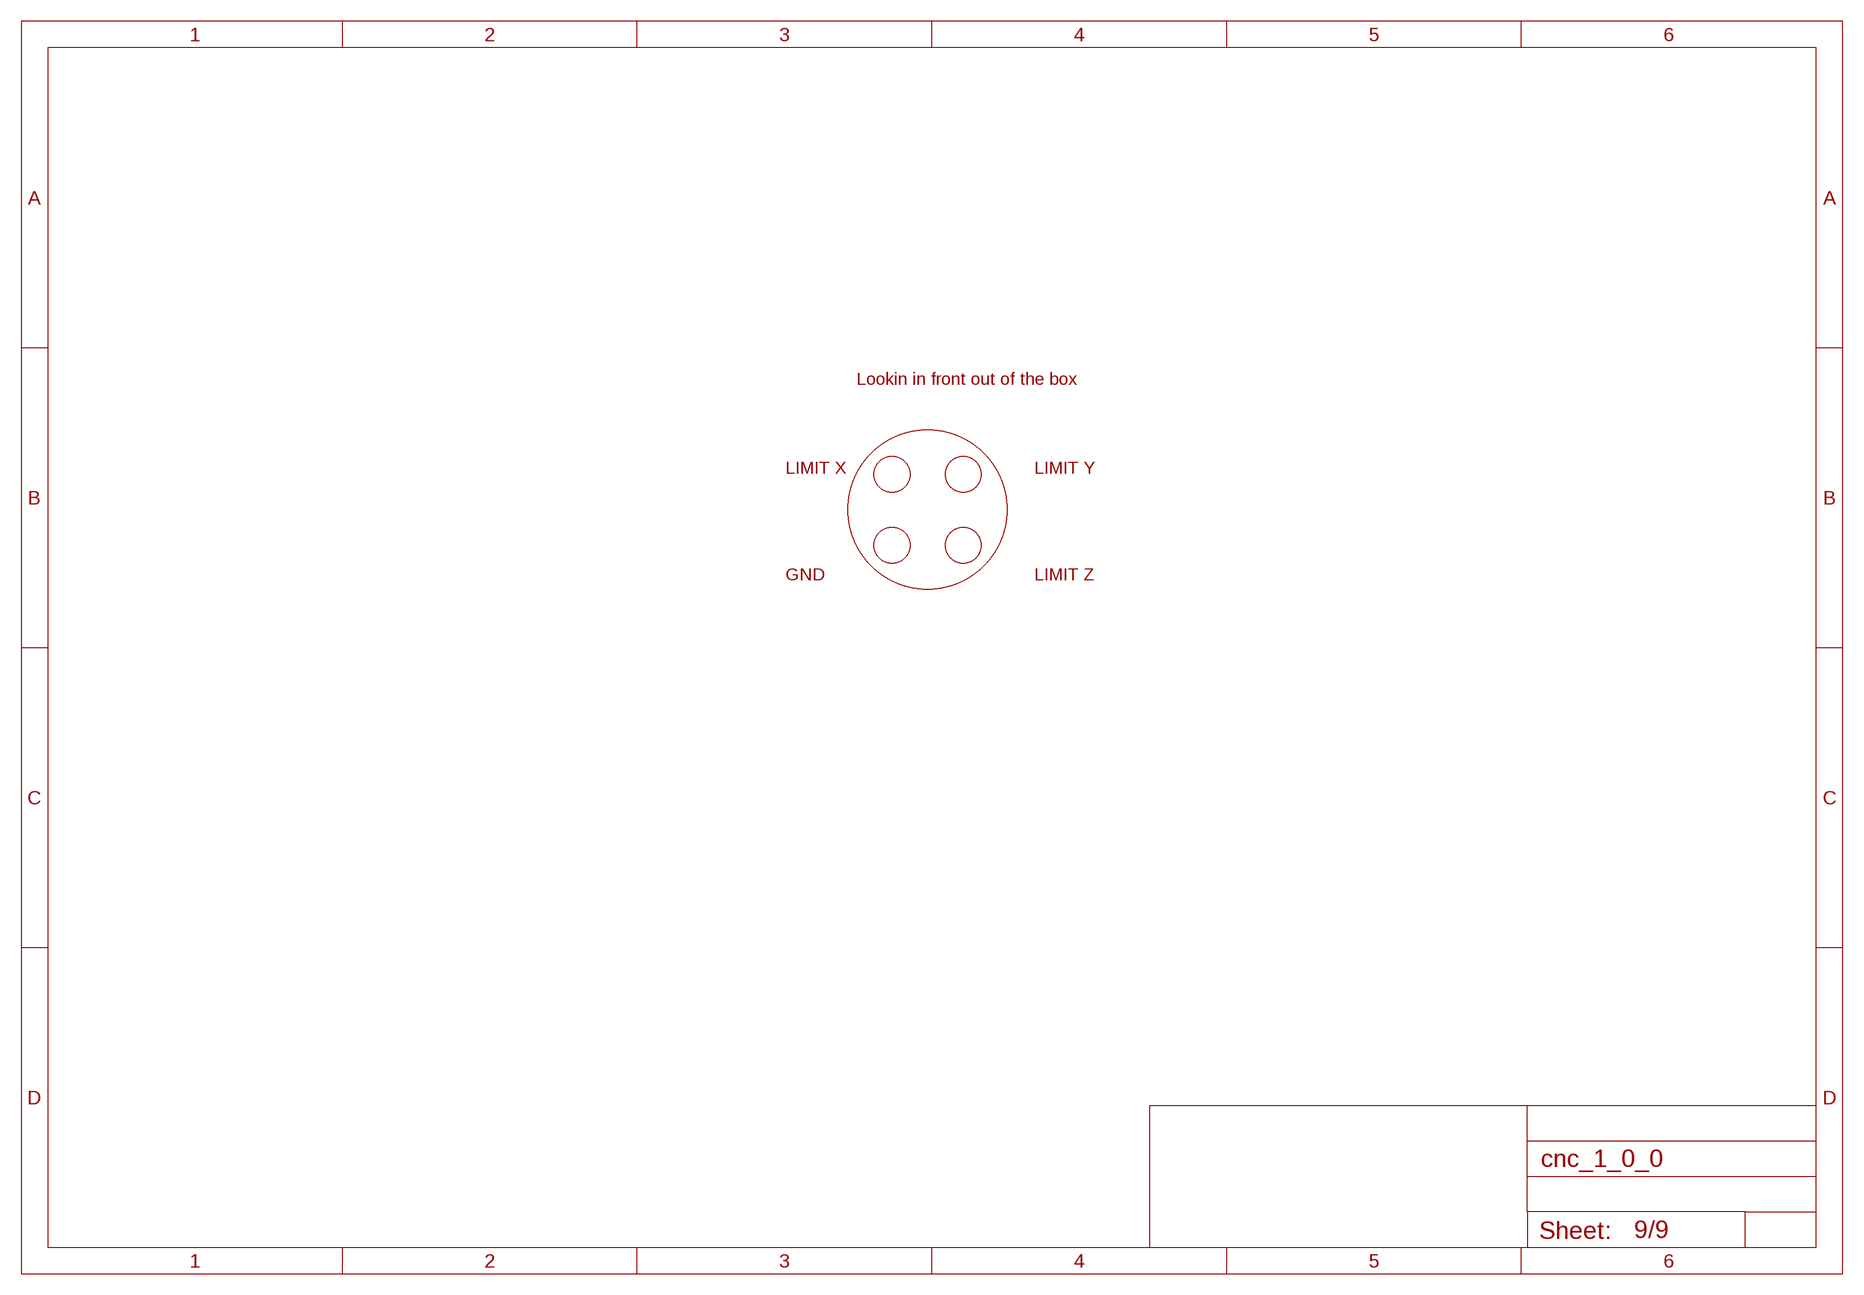
[diagram p8: schematic, sheet 9]

### Notes on the sheet
- Lookin in front out of the box
- LIMIT X | LIMIT Y
- GND | LIMIT Z

## Library data of the parts
C1-C41 = rcl:C-EU: CAPACITOR, European symbol
D1 D2 = diode:DIODE-: DIODE; LOMEX: 83-00-93
IC1 IC5 = linear:78*: Positive VOLTAGE REGULATOR Source: http://cache.national.com/ds/LM/LM78L05.pdf http://www.fairchildsemi.com/ds/LM/LM7805.pdf
IC2-IC4 = 45xx:4504: TTL or CMOS to CMOS hex LEVEL SHIFTER
IC6 = IsolatedDCDC:IL0512S
IC7 = 74xx-eu:74*244: Octal BUFFER and LINE DRIVER, 3-state
IC8 = linear:OPA*-SOT23: Single Operational Amplifier Low Power, Single-Supply, Rail-To-Rail Operational Amplifier Source: http://focus.ti.com/lit/ds/symlink/opa2345.pdf
IC9 = cnc:TR10
JP1 = pinhead:PINHD-1X8: PIN HEADER
JP2 JP20 JP21 = pinhead:PINHD-1X2: PIN HEADER
JP3 JP39 JP40 = pinhead:PINHD-1X1: PIN HEADER
K1 K2 = relay:G2R2: RELAY 2 x switch, Omron; MF: OMRON COMPONENTS USA; MPN: G2R-2-DC6; OC_FARNELL: unknown; OC_NEWARK: 89C5317
L1 = rcl:L-US: INDUCTOR, American symbol
L2 = inductors:DR127: High Power Density, High Efficiency, Shielded Inductors Source: coiltronics_dr_series.pdf
L4 = SparkFun:INDUCTOR: Inductors Basic Inductor/Choke - 0603 and 1206. Footprints are not proven and vary greatly between part numbers.
OK4 = optocoupler:TLP283-4: TOSHIBA PHOTOCOUPLER GaAs IRED & PHOTO-TRANSISTOR Source: http://www.semicon.toshiba.co.jp/td/en/Opto/Photocoupler/en_20050928_TLP283_datasheet.pdf; OC_FARNELL: unknown; OC_NEWARK: unknown
Q2 = SparkFun:CRYSTAL: Crystals Various standard crystals. Proven footprints. Spark Fun Electronics SKU : COM-00534
Q4 Q5 = transistor-npn:BCW33*: NPN Transistor
Q7 = transistor-small-signal:BSS84: P-CHANNEL MOS FET; FARNELL: 1094997; LOMEX: 86-03-04
R1-R25 R79-R82 R124 = rcl:R-EU_: RESISTOR, European symbol
SJ1-SJ5 = jumper:SJ: SMD solder JUMPER
SV1 SV2 = con-lstb:MA20-1: PIN HEADER; OC_FARNELL: unknown; OC_NEWARK: unknown
U2 = microchip-enc28j60:ENC28J60-*: Microchip 10Mbit Eth. contoller with SPI interface
U$15 = Controller2:AMPHENOL-LMJ2018814100DL2T1B_LMJ2018814100DL
UEXT = con-harting-ml:ML10: HARTING
X1 = con-subd:F25HP: SUB-D; OC_FARNELL: unknown; OC_MOUSER: https://www.mouser.de/ProductDetail/636-182-025-113R531; OC_NEWARK: unknown
X2-X7 = con-phoenix-508:MSTBA2: PHOENIX; MF: FARNELL; MPN: 1757242; OC_FARNELL: 3705171; OC_NEWARK: 71C4161

## Net classes
1 pwr: width 0.25 mm
2 signal: width 0.406 mm, clearance 0.406 mm to class 0, clearance 0.406 mm to class 1, clearance 0.406 mm

## Board
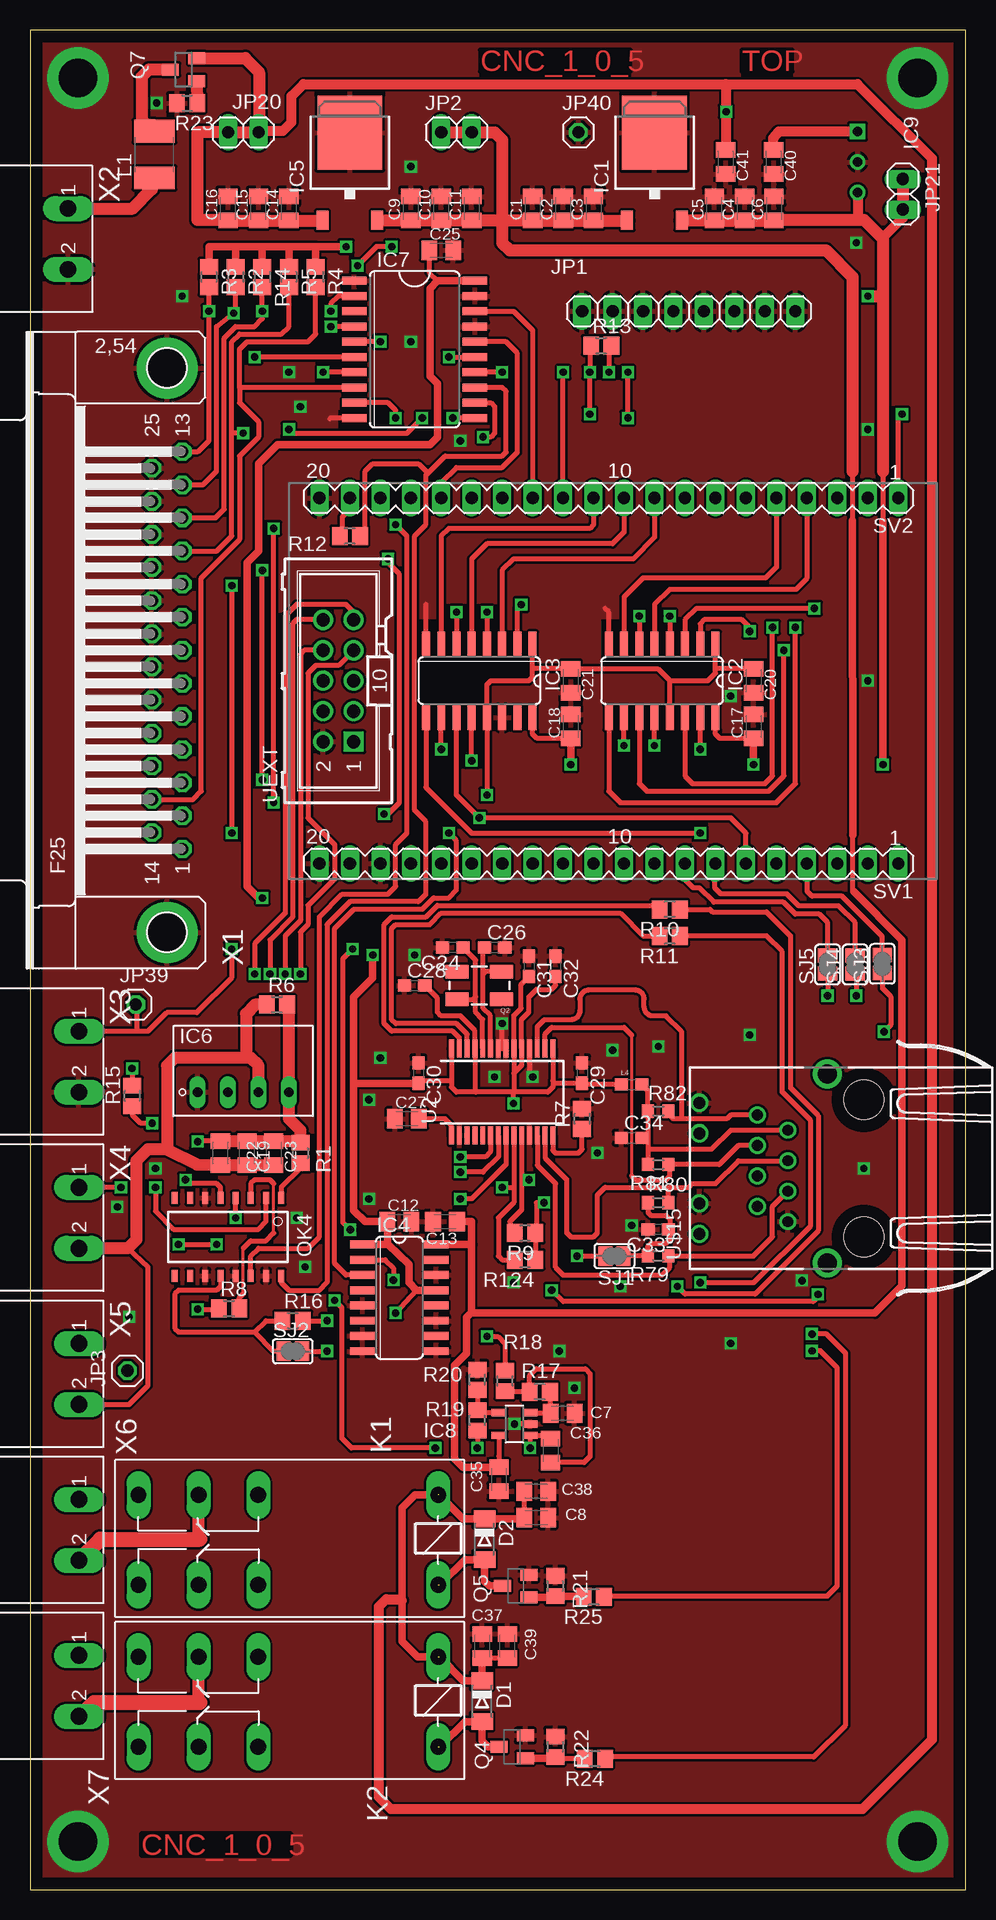
[diagram p9: board, top side]
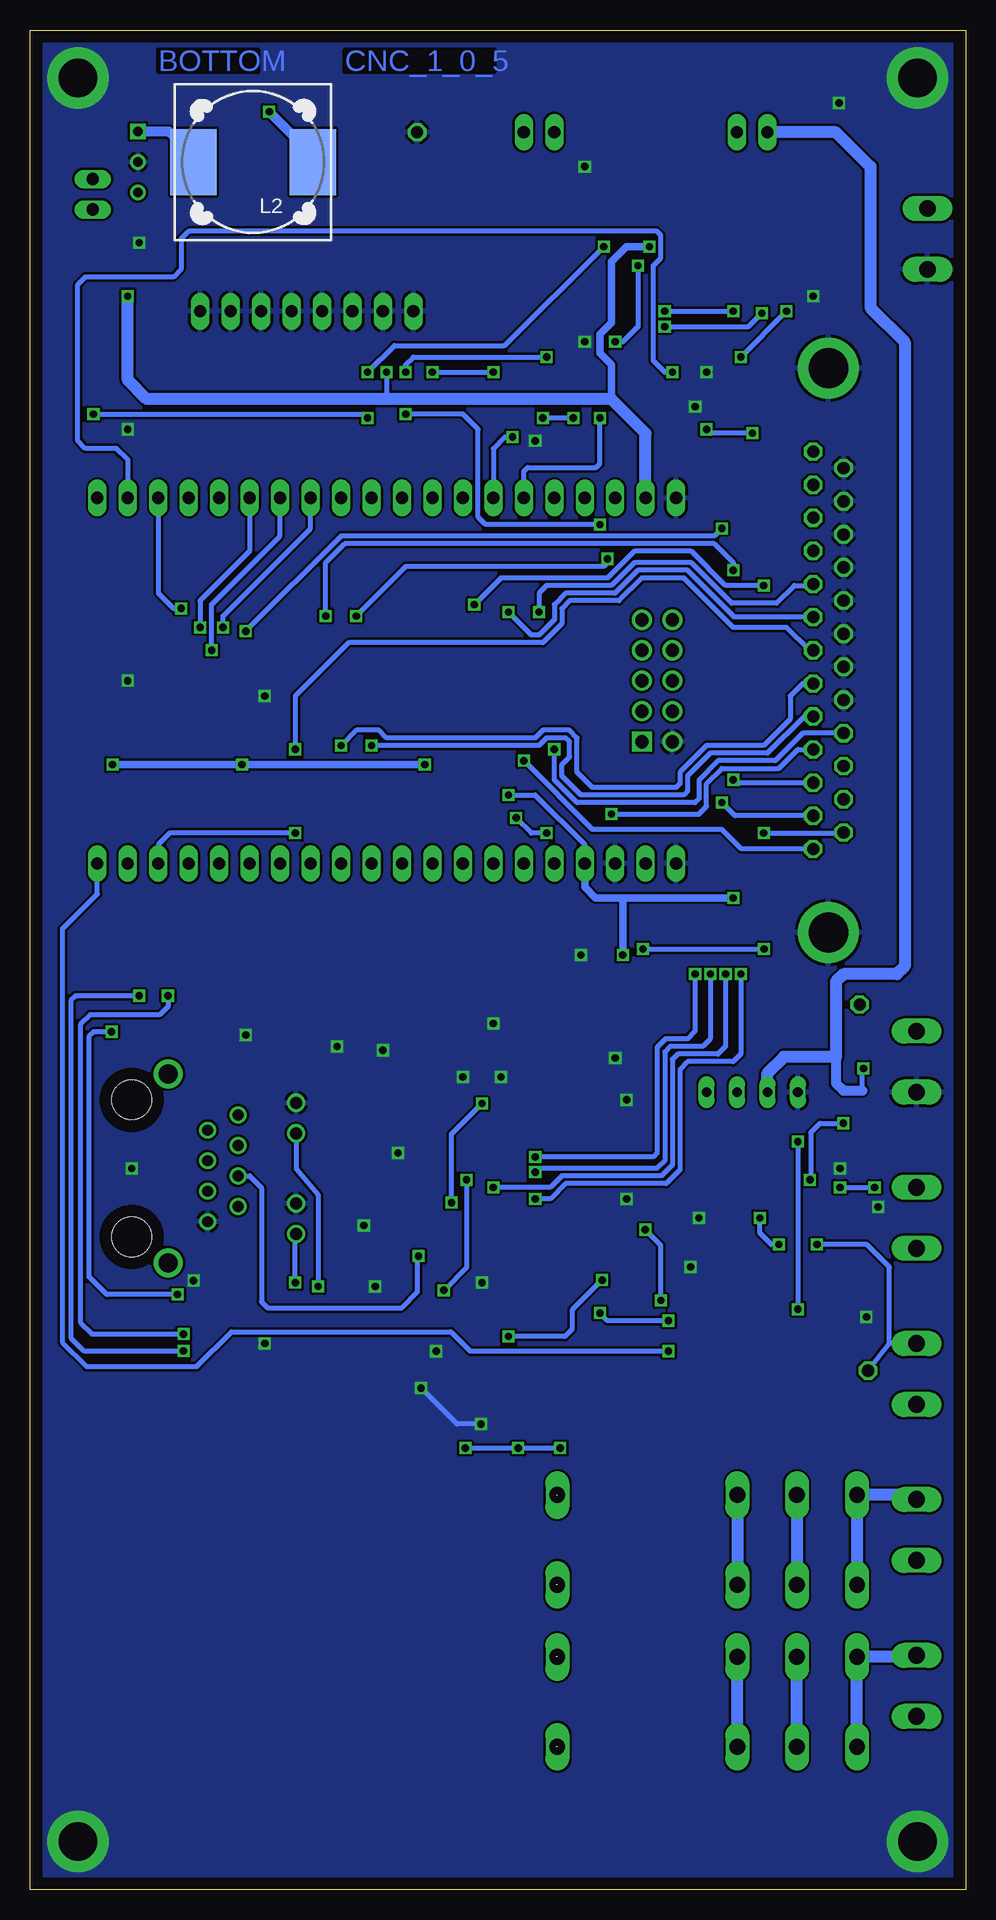
[diagram p10: board, bottom side, seen from below]

Size 78 x 155 mm. Coordinates in mm from the lower left corner, seen from the top.
Outline: 0,0 78,0 78,155 0,155 0,0
Copper layers (1*16): Top 0.035mm / dielectric 1.5mm / Bottom 0.035mm
Design rules: minimum track width 16mil, minimum drill 0.6mm, track to track 8mil, track to pad 8mil, pad to pad 8mil, via to via 8mil, smd to smd 8mil, copper to edge 40mil, drill to drill 8mil, minimum pad ring 10mil, minimum via ring 8mil, stop-mask expansion 4mil, vias tented up to drill 0mil, thermal gap 10mil
tRestrict: area 32.4,102 to 33.7,105.8; area 47.6,102 to 48.9,105.8; area 25.7,122 to 29.5,123.3

### Footprints (pad centres in the part's own frame; a part is rotated, then mirrored left to right if it is on the bottom)
C0805K = smd 1.3 x 1.6: 1 -1,0; 2 1,0
C0603 = smd 1.1 x 1: 1 -0.85,0; 2 0.85,0
MINIMELF = smd 1.4 x 1.8: A 1.7,0; C -1.7,0
TO252 = smd 1 x 1.6: 1 -2.28,-4.8; 2 2.28,-4.8 | smd 5.4 x 6.2: 3 0,2.5
SO16 = smd 0.66 x 2.032: 1 -4.445,-3.073; 2 -3.175,-3.073; 3 -1.905,-3.073; 4 -0.635,-3.073; 5 0.635,-3.073; 6 1.905,-3.073; 7 3.175,-3.073; 8 4.445,-3.073; 9 4.445,3.073; 10 3.175,3.073; 11 1.905,3.073; 12 0.635,3.073; 13 -0.635,3.073; 14 -1.905,3.073; 15 -3.175,3.073; 16 -4.445,3.073
SIL4 = drill 0.813 long: 1 0,0; 2 2.54,0; 3 5.08,0; 4 7.62,0
SO20W = smd 0.66 x 2.032: 1 -5.715,-5.029; 2 -4.445,-5.029; 3 -3.175,-5.029; 4 -1.905,-5.029; 5 -0.635,-5.029; 6 0.635,-5.029; 7 1.905,-5.029; 8 3.175,-5.029; 9 4.445,-5.029; 10 5.715,-5.029; 11 5.715,5.029; 12 4.445,5.029; 13 3.175,5.029; 14 1.905,5.029; 15 0.635,5.029; 16 -0.635,5.029; 17 -1.905,5.029; 18 -3.175,5.029; 19 -4.445,5.029; 20 -5.715,5.029
SOT23-5 = smd 0.6 x 1.2: 1 -0.95,-1.306; 2 0,-1.306; 3 0.95,-1.306; 4 0.95,1.306; 5 -0.95,1.306
TR10 = drill 0.8 square: P$1 -2.54,0 | drill 0.8: P$2 0,0; P$3 2.54,0
1X08 = drill 1.016 long: 1 -8.89,0; 2 -6.35,0; 3 -3.81,0; 4 -1.27,0; 5 1.27,0; 6 3.81,0; 7 6.35,0; 8 8.89,0
1X02 = drill 1.016 long: 1 -1.27,0; 2 1.27,0
1X01 = drill 1.016 octagon: 1 0,0
G2R2 = drill 1.321 long: 1 -2.54,-3.683; 2 -2.54,3.81; O1 12.471,3.81; O2 12.471,-3.683; P1 17.45,3.81; P2 17.45,-3.683; S1 22.454,3.81; S2 22.454,-3.683
L1812 = smd 1.9 x 3.4: 1 -1.95,0; 2 1.95,0
DR127 = smd 3.85 x 5.5: 1 -4.975,0; 2 4.975,0
0603 = smd 1.1 x 1: 1 -0.85,0; 2 0.85,0
MINI-FLAT-16 = smd 1 x 0.5: 1 -3.24,4.445; 2 -3.24,3.175; 3 -3.24,1.905; 4 -3.24,0.635; 5 -3.24,-0.635; 6 -3.24,-1.905; 7 -3.24,-3.175; 8 -3.24,-4.445; 9 3.24,-4.445; 10 3.24,-3.175; 11 3.24,-1.905; 12 3.24,-0.635; 13 3.24,0.635; 14 3.24,1.905; 15 3.24,3.175; 16 3.24,4.445
CRYSTAL-SMD-5X3 = smd 1.9 x 1.1: 1 -1.85,-1.15; 2 1.85,-1.15; 3 1.85,1.15; 4 -1.85,1.15
SOT23-BEC = smd 1 x 1.4: B -0.95,-1.1; C 0,1.1; E 0.95,-1.1
SOT23 = smd 1 x 1.4: 1 -0.95,-1.1; 2 0.95,-1.1; 3 0,1.1
R0805 = smd 1.3 x 1.5: 1 -0.85,0; 2 0.85,0
R0603 = smd 1 x 1.1: 1 -0.85,0; 2 0.85,0
SJ = smd 1.168 x 1.6: 1 -0.762,0; 2 0.762,0
MA20-1 = drill 1.016 long: 1 -24.13,0; 2 -21.59,0; 3 -19.05,0; 4 -16.51,0; 5 -13.97,0; 6 -11.43,0; 7 -8.89,0; 8 -6.35,0; 9 -3.81,0; 10 -1.27,0; 11 1.27,0; 12 3.81,0; 13 6.35,0; 14 8.89,0; 15 11.43,0; 16 13.97,0; 17 16.51,0; 18 19.05,0; 19 21.59,0; 20 24.13,0
SSOP28 = smd 0.4 x 1.5: 1 -4.225,-3.625; 2 -3.575,-3.625; 3 -2.925,-3.625; 4 -2.275,-3.625; 5 -1.625,-3.625; 6 -0.975,-3.625; 7 -0.325,-3.625; 8 0.325,-3.625; 9 0.975,-3.625; 10 1.625,-3.625; 11 2.275,-3.625; 12 2.925,-3.625; 13 3.575,-3.625; 14 4.225,-3.625; 15 4.225,3.625; 16 3.575,3.625; 17 2.925,3.625; 18 2.275,3.625; 19 1.625,3.625; 20 0.975,3.625; 21 0.325,3.625; 22 -0.325,3.625; 23 -0.975,3.625; 24 -1.625,3.625; 25 -2.275,3.625; 26 -2.925,3.625; 27 -3.575,3.625; 28 -4.225,3.625
AMPHENOL-LMJ2018814100DL2T1B_RJ45 = drill 0.9 pad 1.3: 1 4.445,5.08; 2 3.175,2.54; 3 1.905,5.08; 4 0.635,2.54; 5 -0.635,5.08; 6 -1.905,2.54; 7 -3.175,5.08; 8 -4.445,2.54 | drill 1 pad 1.422: 9 -5.465,9.91; 10 -2.925,9.91; 11 2.925,9.91; 12 5.465,9.91 | drill 1.6 pad 2.184: M1 -7.875,-0.76; M2 7.875,-0.76 | hole 3.3: 5.715,-3.81; -5.715,-3.81
ML10-MALE = drill 1.1 pad 1.676 square: 1 -5.08,-1.27 | drill 1.1 pad 1.676: 2 -5.08,1.27; 3 -2.54,-1.27; 4 -2.54,1.27; 5 0,-1.27; 6 0,1.27; 7 2.54,-1.27; 8 2.54,1.27; 9 5.08,-1.27; 10 5.08,1.27
F25HP = drill 1.016 octagon: 1 -16.561,-1.27; 2 -13.792,-1.27; 3 -11.049,-1.27; 4 -8.28,-1.27; 5 -5.512,-1.27; 6 -2.769,-1.27; 7 0,-1.27; 8 2.769,-1.27; 9 5.512,-1.27; 10 8.28,-1.27; 11 11.049,-1.27; 12 13.792,-1.27; 13 16.561,-1.27; 14 -15.189,1.27; 15 -12.421,1.27; 16 -9.652,1.27; 17 -6.909,1.27; 18 -4.14,1.27; 19 -1.372,1.27; 20 1.372,1.27; 21 4.14,1.27; 22 6.909,1.27; 23 9.652,1.27; 24 12.421,1.27; 25 15.189,1.27 | drill 3.302 pad 5.08: G1 -23.52,0; G2 23.52,0
MSTBA2 = drill 1.397 long: 1 -2.54,5.08; 2 2.54,5.08

### Placement (x,y rotation side)
C1  41.91,140.12 90 top
C2  44.45,140.12 90 top
C3  46.99,140.12 90 top
C4  59.59,140.12 90 top
C5  57.05,140.12 90 top
C6  62.03,140.12 90 top
C7  44.4,39.7 0 top
C8  42.2,31 0 top
C9  31.75,140.12 90 top
C10  34.29,140.12 90 top
C11  36.83,140.12 90 top
C12  30.8,55.67 0 top
C13  34.61,55.67 180 top
C14  21.59,140.12 90 top
C15  19.05,140.12 90 top
C16  16.51,140.12 90 top
C17  60.33,96.94 90 top
C18  45.09,96.94 90 top
C19  18.1,61.38 270 top
C20  60.33,100.75 270 top
C21  45.09,100.75 270 top
C22  15.88,61.38 270 top
C23  20.32,61.38 270 top
C24  35.24,78.53 180 top
C25  34.29,136.63 0 top
C26  38.73,78.53 0 top
C27  31.43,64.24 0 top
C28  32.07,75.36 0 top
C29  46.04,68.05 270 top
C30  32.38,68.05 270 top
C31  41.59,76.94 270 top
C32  43.81,76.94 270 top
C33  52.39,55.03 180 top
C34  50.16,62.66 0 top
C35  39.1,34.2 270 top
C36  43.4,36.6 90 top
C37  37.7,20.3 90 top
C38  42.2,33.2 0 top
C39  39.8,20.3 90 top
C40  62,144 270 top
C41  58,144 270 top
D1  37.7,15.7 270 top
D2  37.9,29.2 270 top
IC1  52.07,143.94 0 top
IC2  52.7,100.75 180 top
IC3  37.47,100.75 180 top
IC4  30.8,49.32 270 top
IC5  26.67,143.94 0 top
IC6  13.97,66.47 0 top
IC7  32.07,128.38 270 top
IC8  40.4,38.8 90 top
IC9  69,144 270 top
JP1  54.93,131.55 0 top
JP2  35.56,146.47 0 top
JP3  8.13,43.25 90 top
JP20  17.78,146.47 0 top
JP21  72.78,141.31 270 top
JP39  8.82,73.77 0 top
JP40  45.72,146.47 0 top
K1  31.5,29.2 180 top
K2  31.5,15.7 180 top
L1  10.38,144.61 90 top
L2  59.4,144 180 bottom
L4  50.16,67.1 0 top
OK4  16.51,54.4 270 top
Q2  37.47,75.36 180 top
Q4  40.2,11.9 90 top
Q5  40.5,25.3 90 top
Q7  12.8,151.7 90 top
R1  22.54,61.38 270 top
R2  17.14,134.41 270 top
R3  14.92,134.41 270 top
R4  23.81,134.41 270 top
R5  21.59,134.41 270 top
R6  20.59,73.77 0 top
R7  46.04,64.24 90 top
R8  16.59,48.43 0 top
R9  41.27,54.72 180 top
R10  53.34,81.7 180 top
R11  53.34,79.48 180 top
R12  26.67,112.82 180 top
R13  47.62,128.69 0 top
R14  19.37,134.41 270 top
R15  8.54,66.16 90 top
R16  21.91,47.41 0 top
R17  42.5,41.5 180 top
R18  39.6,42.4 90 top
R19  37.3,39.1 90 top
R20  37.3,42.5 90 top
R21  43.8,25.3 270 top
R22  43.8,11.9 270 top
R23  13.1,148.9 0 top
R24  47.1,10.9 180 top
R25  47,24.4 180 top
R79  52.39,52.81 180 top
R80  52.39,57.26 0 top
R81  52.39,60.43 180 top
R82  52.39,64.88 0 top
R124  41.27,52.49 180 top
SJ1  48.73,52.8 180 top
SJ2  21.91,44.88 0 top
SJ3  71.06,77.15 90 top
SJ4  68.8,77.1 90 top
SJ5  66.5,77.1 90 top
SV1  48.26,85.52 180 top
SV2  48.26,116 180 top
U2  39.37,66.47 0 top
U$15  65.72,60.12 90 top
UEXT  25.71,100.75 90 top
X1  11.43,103.3 90 top
X2  -1.91,137.59 270 top
X3  -1,69 270 top
X4  -1,55.99 270 top
X5  -1,42.97 270 top
X6  -1,29.97 270 top
X7  -1,16.97 270 top

### Tracks (layer width: path | path; a pad name or v marks a point on that pad's centre or on a via)
!PROBE_ISOLATED  (via drill 0.6)
  Top 0.406: OK4.14 18.41,52.81 19.05,53.45 23.18,53.45 24.13,54.4 24.13,81.07 26.04,82.97 29.84,82.97 30.48,83.61 30.48,87.1 31.43,88.06 31.43,112.82 v30.48,113.77 | v46.67,122.98 v46.67,126.47 46.67,128.69 R13.1 | v34.92,127.74 IC7.15
  Bottom 0.406: v30.48,113.77 40.01,113.77 40.64,114.41 40.64,121.71 41.91,122.98 v46.67,122.98 | v46.67,126.47 46.67,127.11 46.04,127.74 v34.92,127.74
+3V3  (via drill 0.6)
  Top 0.406: 41.91,101.71 41.91,101.07 41.59,100.75 38.42,100.75 38.1,100.44 IC3.13 v38.1,91.23 | 41.91,101.71 IC3.1 | IC2.13 53.34,100.75 | 53.34,100.75 56.52,100.75 57.15,101.39 57.15,101.71 | 57.15,101.71 IC2.1 | C20.1 57.2,101.75 57.15,101.71 | 41.91,101.71 41.96,101.75 C21.1 52.34,101.75 53.34,100.75 | U2.15 43.59,67.42 | 43.59,67.42 43.59,66.88 43.18,66.47 40.32,66.47 | 40.32,66.47 37.15,66.47 | 37.15,66.47 35.56,66.47 35.15,66.88 35.15,67.42 | U2.28 35.15,67.42 | 37.15,66.47 37.09,66.52 U2.25 37.09,71.6 35.88,72.81 34.29,72.81 33.97,73.13 33.97,74.3 C28.2 | 43.81,75.67 C32.2 43.81,75.36 43.5,75.04 42.23,75.04 41.59,74.4 41.59,73.13 40.99,72.53 U2.19 40.99,68.7 40.34,68.05 | 40.34,68.05 U2.20 40.32,70.11 40.32,72.81 40.96,73.45 40.96,75.46 C31.2 | 40.34,68.05 40.34,66.49 40.32,66.47 | C30.2 32.49,67.42 35.15,67.42 | 43.59,67.42 43.81,67.2 C29.2 46.46,67.1 L4.1 | v42.86,57.26 42.23,57.26 42.23,54.82 R9.1 R124.1 | v40.32,65.51 40.32,66.47 | C25.1 33.29,134.78 33.97,134.09 | R16.2 v24.77,47.41 | v30.48,48.05 30.48,48 32.23,49.95
  Top 0.61: SV1.17 31.75,86.78 | IC7.20 33.97,134.09 33.34,133.46 33.34,126.16 33.97,125.52 33.97,121.08 33.34,120.44 20.64,120.44 19.05,118.85 19.05,111.55 18.1,110.6 18.1,83.61 19.05,82.66 v19.37,82.66 | IC4.13 32.23,49.95 31.6,50.59 31.6,52.11 29.84,53.77 | 29.84,53.77 IC4.1 | 29.84,53.77 29.8,53.81 C12.1 27.94,55.67 26.99,56.62 26.99,67.42 | v28.57,77.89 28.57,75.99 26.99,74.4 26.99,67.42 | v28.57,77.89 28.57,77.95 28.63,77.89 v28.57,77.89 | C30.2 27.2,67.2 26.99,67.42
  Bottom 0.406: v38.1,91.23 35.88,91.23 31.75,87.1 SV1.17 | v42.86,57.26 42.86,62.97 v40.32,65.51 | v24.77,47.41 29.84,47.41 v30.48,48.05
  Bottom 0.61: 28.57,82.66 30.85,82.66 31.75,83.56 SV1.17 | 28.57,82.66 v28.57,77.89 | v19.37,82.66 28.57,82.66
+5V  (via drill 0.6)
  Top 0.406: 71.12,118.22 71.12,114.09 | C18.1 42.27,95.94 41.91,96.31 IC3.16 | C17.1 57.52,95.94 57.15,96.31 IC2.16 | R13.2 48.48,128.59 48.26,128.38 v48.26,126.47 | SV2.19 26.67,115.04 26.04,114.41 26.04,113.03 R12.2
  Top 0.61: 71.12,114.09 v71.12,93.77 | C17.1 v60.33,93.77 | v45.09,93.77 C18.1 | 23.81,136.95 21.59,136.95 | 21.59,136.95 19.37,136.95 | 19.37,136.95 17.14,136.95 | 17.14,136.95 14.92,136.95 R3.1 | R2.1 17.14,136.95 | R14.1 19.37,136.95 | R5.1 21.59,136.95 | R4.1 23.81,136.95 | 23.81,136.95 v26.35,136.95
  Top 0.813: IC9.P$3 69,139.17 | JP21.2 72.78,139.34 71.12,137.69
  Top 1.016: IC1.2 57.14,139.13 C5.1 58.69,139.12 58.74,139.17 59.64,139.17 C4.1 C6.1 62.28,139.17 69,139.17 69.53,139.17 71.12,137.59 | JP21.1 JP21.2 | 71.12,137.59 71.12,133.14 | 71.12,133.14 71.12,118.22 | v69.85,132.82 70.8,132.82 71.12,133.14 | 71.12,137.59 71.12,137.69
  Bottom 0.406: v48.26,126.47 48.26,124.25
  Bottom 0.61: v71.12,93.77 v60.33,93.77 v45.09,93.77 | v26.35,136.95 28.26,136.95 29.53,135.68 29.53,130.6 30.48,129.65 30.48,128.06 29.53,127.11 29.53,124.25
  Bottom 1.016: v69.85,132.82 69.85,125.84 68.26,124.25 48.26,124.25 29.53,124.25 26.67,121.39 SV2.19
+10V
  Top 0.406: 68.58,118.22 68.58,114.09 | IC8.5 39.09,36.11 C35.1 | 68.68,83.19 68.6,83.31 68.6,87.9
  Top 0.61: 68.68,83.19 72.71,79.17 72.71,50.31 70.45,48.05 36.9,48.05 36.83,48.12 | 36.83,48.12 36.83,53.77 | C13.1 36.83,55.67 36.83,53.77 | IC4.16 36.83,53.77 | 68.58,114.09 68.6,87.9 | 36.83,48.12 36.4,47.69 36.4,44.7 35.4,43.7 35.4,35.9 36.1,35.2 C35.1
  Top 1.016: IC5.2 C9.1 C10.1 C11.1 39.37,139.12 | 39.37,139.12 C1.1 C2.1 C3.1 IC1.1 | 39.37,139.12 39.37,145.84 38.73,146.47 JP2.2 JP2.1 | 39.37,139.12 39.37,137.27 40.01,136.63 66.36,136.63 68.58,134.41 68.58,118.22
+10V1  (via drill 0.6)
  Top 0.406: C22.1 14.02,62.38 v13.97,62.34 | v13.97,48.37 15.49,48.37 R8.1
  Top 1.016: C22.1 C19.1 C23.1 22.49,62.38 R1.1 22.54,63.29 21.59,64.24 IC6.4 21.59,73.62 R6.2
  Bottom 0.406: v13.97,62.34 v13.97,48.37
+12V  (via drill 0.6)  (2 unrouted)
  Top 0.406: C37.1 C39.1 | C38.1 C8.1 | v8.51,68.45 8.51,67.04 R15.2
  Top 0.61: C37.1 D1.C 36.12,17.4 34.14,19.38 32.32,19.38 31,20.7 31,24.1 31,31.8 32.1,32.9 34.12,32.9 36.12,30.9 D2.C 41,30.9 C8.1
  Top 0.813: 19.1,146.6 21.1,146.6 21.8,147.3 21.8,149.5 22.8,150.5 58,150.5 | 58,150.5 69,150.5 75.2,144.3 75.2,12.5 69.4,6.7 30.1,6.7 29.1,7.7 29.1,23.6 29.7,24.2 30.9,24.2 31,24.1 | 58,150.5 58.05,150.45 v58.05,148.2 58.05,145.05 C41.1
  Top 1.016: IC5.1 C14.1 C15.1 C16.1 16.46,139.17 13.97,139.17 13.97,146.47 JP20.1 JP20.2 19.1,146.53 19.1,146.6 19.1,151.5 17.95,152.65 Q7.2
  Bottom 0.406: 8.6,66.6 8.6,68.36 v8.51,68.45
  Bottom 0.813: 10.79,69.41 10.79,67.19 10.2,66.6 8.6,66.6 | L2.1 54.42,144.57 v58.05,148.2
  Bottom 1.016: IC6.2 16.51,68.05 15.16,69.4 10.8,69.4 10.79,69.41 10.79,75.67 10.16,76.31 5.71,76.31 5.08,76.94 5.08,129.01 7.94,131.87 7.94,143.62 10.79,146.47 JP20.1
ABORT  (via drill 0.6)
  Top 0.406: X1.10 15.58,111.58 16.83,112.82 16.83,121.39 | 16.83,121.39 16.83,129.01 17.46,129.65 20.95,129.65 21.59,130.28 R5.2 | IC7.11 v35.24,122.66 | v17.78,121.39 16.83,121.39 | v21.59,121.71 21.91,121.39 31.43,121.39 v32.7,122.66
  Bottom 0.406: v17.78,121.39 21.27,121.39 v21.59,121.71 | v32.7,122.66 v35.24,122.66
CT1
  Top 0.406: U$15.2 58.42,63.29 56.83,61.7 51.54,61.7 | L4.2 51.54,66.58 R82.1 51.54,62.34 | 51.54,62.34 51.54,61.7 | 51.54,61.7 R81.2 | C34.2 51.54,62.34
DIRECTION_A  (via drill 0.6)
  Top 0.406: 12.7,109.01 X1.9 | v35.56,106.47 IC3.6
  Bottom 0.406: 35.56,106.68 v35.56,106.47 35.56,108.06 34.92,108.69 29.53,108.69 27.62,110.6 22.86,110.6 19.48,107.22 15.76,107.22 14.29,108.69 12.81,108.69 X1.9
DIRECTION_X  (via drill 0.6)
  Top 0.406: v19.37,92.5 v19.37,109.96 | v53.34,106.15 IC2.4
  Bottom 0.406: X1.3 18.99,92.25 v19.37,92.5 | v53.34,106.15 53.34,110.6 51.75,112.19 20.95,112.19 19.37,110.6 v19.37,109.96
DIRECTION_Y  (via drill 0.6)
  Top 0.406: v49.53,95.36 IC2.10
  Bottom 0.406: X1.5 13.45,97.78 16.51,94.72 21.27,94.72 23.18,92.82 23.18,91.55 23.5,91.23 32.07,91.23 33.66,92.82 33.66,93.77 33.02,94.41 33.02,95.67 33.34,95.99 34.92,95.99 35.56,95.36 v49.53,95.36
DIRECTION_Z  (via drill 0.6)
  Top 0.406: v55.88,95.04 IC2.15
  Bottom 0.406: v55.88,95.04 55.88,99.48 51.44,103.93 35.24,103.93 33.66,105.52 33.66,106.79 33.02,107.42 28.89,107.42 26.99,109.33 23.5,109.33 19.37,105.2 14.92,105.2 13.02,103.3 X1.7
ETH_RST  (via drill 0.6)
  Top 0.406: U2.10 40.99,59.06 | 40.99,59.06 40.99,56.66 40.01,55.67 40.01,54.82 R9.2 | v43.5,49.95 44.45,49 65.3,49 65.7,49.4 v65.7,49.6 | 40.99,59.06 41.49,59.06 v41.59,59.16 | SJ3.1 71.1,76.35 71.1,75.1 71.75,74.44 71.75,72.06 v71.2,71.5
  Bottom 0.406: v41.59,59.16 41.59,51.86 v43.5,49.95 | v71.2,71.5 72.7,71.5 73.1,71.1 73.1,51.1 71.6,49.6 v65.7,49.6
EXTERNAL_POWER
  Top 0.406: OK4.12 15.88,50.27 15.56,49.95 12.38,49.95 12.06,49.64 12.06,46.78 12.38,46.46 18.73,46.46 | 18.73,46.46 19.68,47.41 R16.1 | SJ2.1 20.32,44.88 18.73,46.46
GND  (via drill 0.6, 3.2 pad 5.1)
  Top 0.406: IC2.8 48.26,106.47 47.94,106.79 | IC3.8 33.02,107.11 | 39.05,68.05 v38.73,67.73 | U2.18 41.65,68 v41.91,67.73 | U2.21 39.37,70.09 v39.37,72.18 | IC8.2 v40.4,38.8 | IC7.10 25.06,122.66 25,122.6
  Bottom 0.406: v40.4,38.8 42.4,38.8 v45.4,41.8
  other vias: 58.42,99.48 31.75,143.62 68.9,137.27 31.75,129.01 21.59,126.47 69.85,100.75 4,151 74,151 74,4 4,4 35.88,120.76 10.46,60.12 7.29,56.89 12.7,132.82 50.16,55.35 52.39,70.28 48.58,69.96 47.31,61.38 40.32,50.59 28.26,65.83 58.42,45.51 44.13,44.88 60.01,71.23 69.53,60.12 64.37,50.76 32.07,77.89 29.21,69.32 28.26,57.58 69.85,121.71 22.54,123.61 22.23,55.99 49.21,50.27 8.26,47.73 22.93,51.89 10.55,148.92
  pour Bottom: -3.54,157.91 27.94,157.91 27.94,165.53 49.53,165.53 49.53,157.91 80.01,157.91 80.01,-3.63 -3.54,-3.63
  pour Top: -3.54,157.91 1.27,157.91 1.27,165.53 19.05,165.53 19.05,157.91 80.01,157.91 80.01,-3.63 -3.54,-3.63
LIMIT_X  (via drill 0.6)
  Top 0.406: X1.11 15.49,114.34 16.19,115.04 16.19,129.33 17.14,130.28 18.73,130.28 19.37,130.92 v19.37,131.55 R14.2 | IC7.2 25.72,132.82 25.08,132.19 v25.08,131.55
  Bottom 0.406: v25.08,131.55 v19.37,131.55
LIMIT_Y  (via drill 0.6)
  Top 0.406: X1.13 14.02,119.86 14.92,120.76 v14.92,131.55 R3.2 | IC7.6 v18.73,127.74
  Bottom 0.406: v18.73,127.74 v14.92,131.55
LIMIT_Z  (via drill 0.6)
  Top 0.406: X1.12 14.43,117.09 15.56,118.22 15.56,130.28 v16.99,131.39 17.14,131.87 R2.2 | IC7.4 v25.08,130.28
  Bottom 0.406: v25.08,130.28 18.1,130.28 v16.99,131.39
MISO  (via drill 0.6)
  Top 0.406: UEXT.7 25.72,102.03 23.81,102.03 23.18,101.39 23.18,89.33 25.4,87.1 25.4,84.25 23.18,82.02 23.18,80.44 22.54,79.8 v22.54,76.31 | U2.6 38.4,61.5 37.96,61.07 v35.88,61.07
  Bottom 0.406: v22.54,76.31 22.54,71.55 23.18,70.91 25.01,70.91 25.72,70.2 25.72,61.38 26.04,61.07 v35.88,61.07
MIST_AIR  (via drill 0.6)
  Top 0.406: SJ4.1 68.9,76.34 v68.9,74.5 | v65.2,44.9 65.9,44.9 67.3,43.5 67.3,25.3 66.45,24.45 47.85,24.45 R25.1
  Bottom 0.406: v68.9,74.5 74.2,74.5 74.6,74.1 74.6,45.98 73.52,44.9 v65.2,44.9
MIST_OIL  (via drill 0.6)
  Top 0.406: SJ5.1 v66.5,74.5 | v65.2,46.3 66.4,46.3 68,44.7 68,13.7 65.35,11.05 47.95,11.05 R24.1
  Bottom 0.406: v66.5,74.5 66.5,73.6 67.2,72.9 73,72.9 73.8,72.1 73.8,47.28 72.81,46.3 v65.2,46.3
MOSI  (via drill 0.6)
  Top 0.406: UEXT.8 22.86,103.3 22.54,102.98 22.54,80.75 21.27,79.48 v21.27,76.31 | U2.7 39.05,61.06 37.78,59.8 v35.88,59.8
  Bottom 0.406: v21.27,76.31 21.27,70.91 21.91,70.28 24.63,70.28 25.08,69.83 25.08,60.75 25.72,60.12 35.56,60.12 v35.88,59.8
N$1
  Top 1.016: X2.1 8.57,140.12 10.16,141.71 10.16,142.66 L1.1
N$2
  Top 0.406: U2.24 37.74,72.53 37.15,73.13 37.15,74.4 | 37.15,74.4 37.15,77.47 C24.1 | Q2.3 36.95,74.2 37.15,74.4
N$3
  Top 0.406: R18.1 39.65,41.5 R17.2 41.65,42.85 42.2,43.4 46.3,43.4 46.7,43 46.7,36.1 46.2,35.6 C36.1
N$4
  Top 0.406: U2.26 36.45,71.3 35.56,72.18 30.48,72.18 30.16,72.5 30.16,80.12 30.48,80.44 33.34,80.44 34.29,81.39 49.21,81.39 51.12,79.48 R11.2
N$5
  Top 0.406: R1.2 22.54,60.12 20.95,58.53 OK4.1
N$6  (via drill 0.6)
  Top 0.406: v10.46,58.53 10.46,56.53 11.96,55.03 19.05,55.03 19.68,55.67 OK4.2 | v7.58,58.53 X4.1
  Bottom 0.406: v10.46,58.53 v7.58,58.53
N$7
  Top 0.406: X5.2 8.26,40.43 9.84,42.02 9.84,51.87 8.16,53.45
  Top 1.016: IC6.3 19.05,68.69 18.41,69.32 18,69.32 | 18,69.32 12.06,69.32 11.43,68.69 11.43,61.7 | 11.43,61.7 13.97,60.43 13.92,60.43 C22.2 C19.2 C23.2 | 11.43,61.7 9.82,61.7 8.87,60.75 8.87,54.16 8.16,53.45 X4.2 | R6.1 18.77,73.77 18,73 18,69.32
N$8  (via drill 0.6)
  Top 0.406: v45.6,52.8 SJ1.2
  Bottom 0.406: U$15.5 59.68,59.48 58.7,58.5 58.7,49 58.2,48.5 47,48.5 45.7,49.8 45.7,52.7 v45.6,52.8
N$10
  Top 0.406: U2.27 35.8,70.99 35.24,71.55 30.16,71.55 29.53,72.18 29.53,80.44 30.16,81.07 33.02,81.07 33.97,82.02 52.17,82.02 R10.2
N$11
  Top 0.254: 17.78,49.64 17.78,53.45 | 20.32,54.72 20.32,58.84
  Top 0.406: R8.2 17.44,49.3 17.78,49.64 | 17.78,53.45 18.41,54.08 19.68,54.08 20.32,54.72 | 20.32,58.84 20,59.16 18.73,59.16 18.41,58.84 OK4.3
N$12  (via drill 0.6)
  Top 0.406: v12.38,53.77 v15.56,53.77 | v17.14,55.99 OK4.4
  Bottom 0.406: JP3.1 6.35,45.51 | 6.35,45.51 6.35,51.88 8.23,53.77 v12.38,53.77 | v15.56,53.77 16.19,53.77 17.14,54.72 v17.14,55.99 | X5.1 6.35,45.51
N$13  (via drill 0.6)
  Top 0.406: OK4.5 15.88,58.53 15.56,58.84 13.38,58.84 v12.96,59.16 | R15.1 8.54,64.56 9.2,63.9 10.16,63.9 v10.19,63.87
  Bottom 0.406: v12.96,59.16 12.9,59.23 12.9,63.1 12.13,63.87 v10.19,63.87
N$14
  Bottom 1.016: 4.1,19.38 K2.S2 K2.S1
  Bottom 1.27: X7.1 4.1,19.38
N$15
  Top 0.406: IC8.3 43.35,39.75 C7.1 43.4,41.45 R17.1
N$16
  Top 0.406: IC8.4 37.4,39.75 37.4,39.8 | 37.4,39.8 R19.2 37.3,40 37.4,40 37.4,39.8 | R20.1 37.3,39.8 37.4,39.8
N$17
  Bottom 1.016: K2.O1 K2.O2
N$18
  Top 1.016: 14.15,15.6 14.05,15.6 K2.P2
  Top 1.27: X7.2 5.34,15.6 14.15,15.6
  Bottom 1.016: K2.P1 K2.P2
N$19
  Top 1.016: 14.05,29.2 K1.P2
  Top 1.27: X6.2 5.84,29.2 14.05,29.2 14.15,29.2
  Bottom 1.016: K1.P2 K1.P1
N$20
  Bottom 1.016: K1.O2 K1.O1
N$21
  Bottom 1.016: K1.S1 K1.S2 4.15,32.88
  Bottom 1.27: X6.1 4.15,32.88
N$22  (1 unrouted)
  Top 0.61: 34.14,25.39 36.25,27.5 D2.A 37.9,25.7 38.3,25.3 Q5.C
N$23  (1 unrouted)
  Top 0.61: 34.14,11.89 36.25,14 D1.A 37.7,12.4 38.2,11.9 Q4.C
N$24
  Top 1.016: Q7.3 9.9,151.7 9.3,151.1 9.3,147.4 9.9,147.1 10.34,147.1 L1.2
N$25
  Top 1.016: Q7.1 R23.2
N$26
  Top 0.813: C40.1 61.95,145.05 61.95,146 62.41,146.54 IC9.P$1
  Bottom 0.813: L2.2 64.38,144.51 66.4,146.54 IC9.P$1
N$27
  Top 0.406: R24.2 43.8,10.9 R22.2
  Top 0.61: Q4.B 43.7,10.95 R22.2
N$28
  Top 0.61: Q5.B 43.7,24.35 R21.2 46.15,24.45 R25.2
N$53
  Top 0.406: U2.23 38.4,72.84 37.78,73.45 37.78,76.31 | 37.78,76.31 37.78,78.43 C26.1 | Q2.1 37.98,76.5 37.78,76.31
N$54
  Top 0.406: U2.14 43.59,61.6 43.81,61.38 45.72,61.38 46.04,61.7 R7.1
N$55
  Top 0.406: U2.1 35.15,63.7 34.61,64.24 C27.2 33.55,64.24
N$57
  Top 0.406: R80.1 51.54,56.42 51.75,56.2 53.02,56.2 53.34,55.89 53.34,55.14 C33.1 53.34,54.93 53.34,54.18 53.02,53.87 51.75,53.87 51.54,53.65 R79.2 49.49,52.81 SJ1.1
N$74  (via drill 0.6)
  Top 0.406: v53.98,50.27 54.61,49.64 60.46,49.64 65.72,54.9 65.72,64.51 63.4,66.83 63.4,79.5 61.4,81.5 56.9,81.5 56.7,81.7 R10.1
  Bottom 0.406: U$15.11 55.81,60.05 53.98,57.89 v53.98,50.27
N$76  (via drill 0.6)
  Top 0.406: v55.88,50.59 60.35,50.59 65.09,55.33 65.09,64.09 62.72,66.47 62.72,78.18 61.4,79.5 54.21,79.5 R11.1
  Bottom 0.406: v55.88,50.59 55.88,54.58 U$15.9
PROBE
  Top 0.406: X1.15 13.61,90.87 14.29,91.55 14.29,109.33 17.46,112.5 17.46,119.49 19.05,121.08 19.05,122.34 17.46,123.93 17.46,125.2 | 17.46,125.2 17.46,128.38 18.1,129.01 23.18,129.01 23.81,129.65 R4.2 | IC7.8 17.46,125.2
PROBE_ISOLATED
  Top 0.406: 33.18,118.06 33.02,117.9 33.02,113.77 32.07,112.82 32.07,89.96 33.02,89.01 33.02,82.97 32.38,82.34 26.67,82.34 24.77,80.44 24.77,50.59 24.13,49.95 21.59,49.95 20.95,50.59 OK4.16 | 33.18,118.06 34.61,119.49 39.37,119.49 39.69,119.81 39.69,124.89 39.37,125.2 IC7.13 | 33.18,118.06 32.38,118.85 28.57,118.85 27.94,118.22 27.94,112.82 R12.1
RB0
  Top 0.406: SV2.16 34.29,117.27 35.56,118.53 39.37,118.53 40.64,119.81 40.64,128.06 39.69,129.01 IC7.16
RB12
  Top 0.406: SJ5.2 66.5,80.6 65.8,81.3 63.8,81.3 62.8,82.3 57,82.3 55.8,83.5 55.3,83.5 54.7,84.1 54.7,85.42 SV1.8
RB14
  Top 0.406: SJ4.2 68.8,80.6 67.4,82 64.1,82 63.1,83 57.6,83 57.1,83.5 57.1,85.47 SV1.7
RC13  (via drill 0.6)
  Top 0.406: IC7.7 v24.45,126.47
  Bottom 0.406: SV2.2 69.85,119.17 70.8,120.12 73.38,120.12 74.01,120.76 74.01,133.78 73.38,134.41 66.04,134.41 65.41,135.04 65.41,137.59 64.77,138.22 25.72,138.22 25.4,137.9 25.4,136 26.04,135.36 26.04,127.42 25.08,126.47 v24.45,126.47
RC14  (via drill 0.6)
  Top 0.406: SV2.1 72.39,122.66 v72.71,122.98 | v49.85,122.66 v49.85,126.47 | v30.16,136.95 28.89,136.95 v27.3,135.36 | v29.21,129.01 IC7.5
  Bottom 0.406: v72.71,122.98 50.16,122.98 v49.85,122.66 | v49.85,126.47 47.62,128.69 38.42,128.69 v30.16,136.95 | v27.3,135.36 27.3,130.28 28.57,129.01 v29.21,129.01
RD1  (via drill 0.6)
  Top 0.406: IC4.3 26.35,51.23 25.4,52.18 25.4,80.12 26.99,81.7 32.7,81.7 33.66,82.66 34.92,82.66 35.56,83.29 35.56,87.42 v34.92,88.06 | SV1.6 59.69,88.06 58.42,89.33 v37.47,89.33 35.56,91.23 IC3.11
  Bottom 0.406: v34.92,88.06 36.2,88.06 v37.47,89.33
RD1_10V  (via drill 0.6)
  Top 0.406: IC4.2 29.61,52.49 30.3,51.8 v30.3,50.8 | v38.1,46.1 39,46.1 39.6,45.5 R18.2
  Bottom 0.406: v30.3,50.8 32.8,48.3 32.8,46.7 33.4,46.1 v38.1,46.1
RD3
  Top 0.406: SJ3.2 71.06,79.44 67.7,82.8 65.2,82.8 64.8,83.2 64.8,85.48 SV1.4
RD4  (via drill 0.6)
  Top 0.406: IC3.9 33.02,91.86 36.83,88.06 v55.88,88.06
  Bottom 0.406: v55.88,88.06 66.36,88.06 67.31,87.1 SV1.3
RD6  (via drill 0.6)
  Top 0.406: SJ2.2 v24.77,44.88
  Bottom 0.406: v24.77,44.88 41.27,44.88 42.9,46.5 61.2,46.5 64.1,43.6 73.28,43.6 75.3,45.61 75.3,80.07 72.39,82.97 SV1.1
RD7  (via drill 0.6)
  Top 0.406: v30.48,122.66 30.48,123.3 29.84,123.93 IC7.9
  Bottom 0.406: SV2.15 36.83,118.22 36.51,118.53 30.8,118.53 30.48,118.85 v30.48,122.66
RD8  (via drill 0.6)
  Top 0.406: IC7.12 38.42,123.93 38.73,123.61 38.73,121.39 38.42,121.08 v37.78,121.08
  Bottom 0.406: v37.78,121.08 38.42,121.08 39.37,120.12 SV2.14
RD11
  Top 0.406: IC7.18 40.32,131.55 41.91,129.97 SV2.13
RE0  (via drill 0.6)
  Top 0.406: v65.41,106.79 55.56,106.79 54.61,105.83 IC2.3
  Bottom 0.406: SV2.3 67.31,108.06 66.04,106.79 v65.41,106.79
RE1
  Top 0.406: SV2.4 64.77,109.27 63.87,108.38 53.34,108.38 52.07,107.11 IC2.5
RE2
  Top 0.406: SV2.5 62.23,110.23 61.33,109.33 51.12,109.33 49.53,107.74 IC2.7
RE3  (via drill 0.6)
  Top 0.406: IC2.9 48.26,91.55 49.21,90.59 62.23,90.59 63.82,92.18 v63.82,105.2
  Bottom 0.406: SV2.6 59.69,111.55 63.82,107.42 v63.82,105.2
RE4  (via drill 0.6)
  Top 0.406: IC2.11 50.8,92.18 51.44,91.55 61.59,91.55 62.87,92.82 v62.87,103.3
  Bottom 0.406: v62.87,103.3 62.87,107.11 57.15,112.82 SV2.7
RE5  (via drill 0.6)
  Top 0.406: IC2.14 54.61,92.82 55.24,92.18 61.28,92.18 61.91,92.82 v61.91,105.2
  Bottom 0.406: v61.91,105.2 61.91,106.15 54.61,113.45 SV2.8
RE6
  Top 0.406: SV2.9 52.07,112.71 50.27,110.92 40.32,110.92 39.37,109.96 IC3.3
RE7
  Top 0.406: SV2.10 49.53,113.14 48.58,112.19 38.1,112.19 36.83,110.92 IC3.5
RF1
  Top 0.406: SV2.11 46.99,113.77 46.67,113.45 34.92,113.45 34.29,112.82 IC3.7
RG9  (via drill 0.6)
  Top 0.406: SV2.12 v44.45,126.47 | v39.37,126.47 IC7.14
  Bottom 0.406: v44.45,126.47 v39.37,126.47
SCK/LED1  (via drill 0.6)
  Top 0.406: UEXT.9 26.98,106.47 26.35,107.11 22.23,107.11 21.27,106.15 21.27,81.39 18.73,78.85 v18.73,76.31 | U2.8 39.7,60.44 36.83,57.58 v35.88,57.58
  Bottom 0.406: v18.73,76.31 18.73,69.64 19.37,69 23.18,69 23.81,68.37 23.81,59.99 24.96,58.84 33.34,58.84 34.61,57.58 v35.88,57.58
SPINDLE_ANALOG  (via drill 0.6)
  Top 0.406: JP39.1 8.89,73.7 8.89,71.53 8.9,71.55 | C36.2 43.15,37.85 IC8.1 v41.7,36.8 | R19.1 v37.3,36.8 | v33.8,36.8 26.8,36.8 26,37.6 26,48.5 v25.4,49.1 | v26.7,55 26.1,55.6 26.1,77.6 v26.9,78.4 | v16.8,78.4 16.8,76 13.9,73.1 11.4,73.1 9.84,71.55 8.9,71.55 | X3.1 8.9,71.55
  Bottom 0.406: v41.7,36.8 v37.3,36.8 v33.8,36.8 | v25.4,49.1 25.4,53.7 v26.7,55 | v26.9,78.4 v16.8,78.4
SPINDLE_ENABLE  (via drill 0.6)
  Top 0.406: v34.29,95.04 IC3.10
  Bottom 0.406: X1.17 13.58,96.39 15.88,94.09 20.64,94.09 22.23,92.5 22.23,90.91 22.54,90.59 32.38,90.59 34.29,92.5 v34.29,95.04
SPINDLE_PWM  (via drill 0.6)
  Top 0.406: v36.83,94.09 IC3.12
  Bottom 0.406: X1.1 18.68,86.73 20.32,88.37 31.11,88.37 v36.83,94.09
STEP_A  (via drill 0.6)
  Top 0.406: v38.1,106.47 IC3.4
  Bottom 0.406: v38.1,106.47 36.2,104.56 35.56,104.56 34.29,105.83 34.29,107.11 33.34,108.06 29.21,108.06 27.3,109.96 23.18,109.96 19.28,106.06 X1.8
STEP_X  (via drill 0.6)
  Top 0.406: v20.32,90.59 v20.32,113.45 | v60.01,104.88 60.01,105.2 59.37,105.83 56.2,105.83 55.88,105.52 IC2.2
  Bottom 0.406: X1.2 19.23,89.5 v20.32,90.59 | v20.32,113.45 20.95,112.82 52.07,112.82 v60.01,104.88
STEP_Y  (via drill 0.6)
  Top 0.406: v29.53,89.64 29.84,89.64 30.8,90.59 30.8,109.64 29.84,110.6 v29.84,110.92 | v50.8,106.15 IC2.6
  Bottom 0.406: v29.84,110.92 29.84,110.6 30.16,110.28 46.67,110.28 v50.8,106.15 | v29.53,89.64 22.23,89.64 21.59,90.28 21.59,92.18 20.32,93.45 15.56,93.45 13.97,95.04 12.72,95.04 X1.4
STEP_Z  (via drill 0.6)
  Top 0.406: v52.07,95.36 IC2.12
  Bottom 0.406: v52.07,95.36 50.8,96.63 48.9,96.63 48.26,95.99 35.88,95.99 35.24,96.63 33.02,96.63 32.38,95.99 32.38,93.14 31.11,91.86 24.13,91.86 23.81,92.18 23.81,93.14 21.59,95.36 16.83,95.36 14.61,97.58 14.61,99.48 13.56,100.53 X1.6
STEPPER_ENABLE  (via drill 0.6)
  Top 0.406: IC3.2 40.64,106.79 v40.96,107.11 | v16.83,108.69 v16.83,88.06
  Bottom 0.406: v40.96,107.11 38.73,109.33 29.84,109.33 27.62,111.55 22.86,111.55 20,108.69 v16.83,108.69 | v16.83,88.06 10.21,88.06 X1.14
TPIN+
  Top 0.406: U$15.4 59.05,60.75 57.15,58.84 55.24,58.84 54.93,58.53 53.34,58.53 | U2.13 42.95,60.98 44.77,59.16 44.77,54.72 45.09,54.4 46.99,54.4 47.31,54.72 47.31,57.89 47.94,58.53 53.34,58.53 | R80.2 53.24,58.42 53.34,58.53
TPIN-
  Top 0.406: U$15.6 61.91,56.94 61.91,54.4 60.33,52.81 R79.1 53.34,52.71 53.34,51.86 52.7,51.23 44.45,51.23 43.81,51.86 43.81,58.84 42.3,60.37 U2.12
TPOUT+
  Top 0.406: U$15.1 58.42,64.56 58.1,64.24 54.29,64.24 | 54.29,64.24 53.66,64.24 53.24,64.66 R82.2 | U2.17 42.3,71.93 42.86,72.5 45.09,72.5 arc90 45.85,73.26 45.85,74.22 arc-90 46.61,74.98 50.44,74.98 arc-90 51.2,74.22 51.2,73.58 arc90 51.96,72.81 53.02,72.81 54.29,71.55 54.29,64.24
TPOUT-
  Top 0.254: 50.16,71.23 50.16,59.48
  Top 0.406: U$15.3 59.05,62.02 57.47,60.43 R81.1 53.34,60.33 53.34,59.48 53.02,59.16 50.48,59.16 50.16,59.48 | U2.16 42.95,71.31 43.5,71.86 49.53,71.86 50.16,71.23
UEXT_#CS  (via drill 0.6)
  Top 0.406: U2.9 40.34,58.53 | UEXT.10 22.23,105.83 21.91,105.52 21.91,81.07 20,79.17 v20,76.31 | v39.37,58.53 40.34,58.53 | 40.34,58.53 40.34,57.28 39.05,55.99 39.05,52.81 39.37,52.49 R124.2
  Bottom 0.406: v20,76.31 20,70.28 20.64,69.64 24,69.64 24.45,69.19 24.45,60.38 25.35,59.48 33.66,59.48 34.61,58.53 v39.37,58.53

### Text on the board
Top: CNC_1_0_5 | TOP | CNC_1_0_5
Bottom: CNC_1_0_5 | BOTTOM